# Altium project VOU_SOM_CV_V0.0.1.PrjPcb (part 2 of 2)

## Sheet Conn_C.SchDoc
size A1
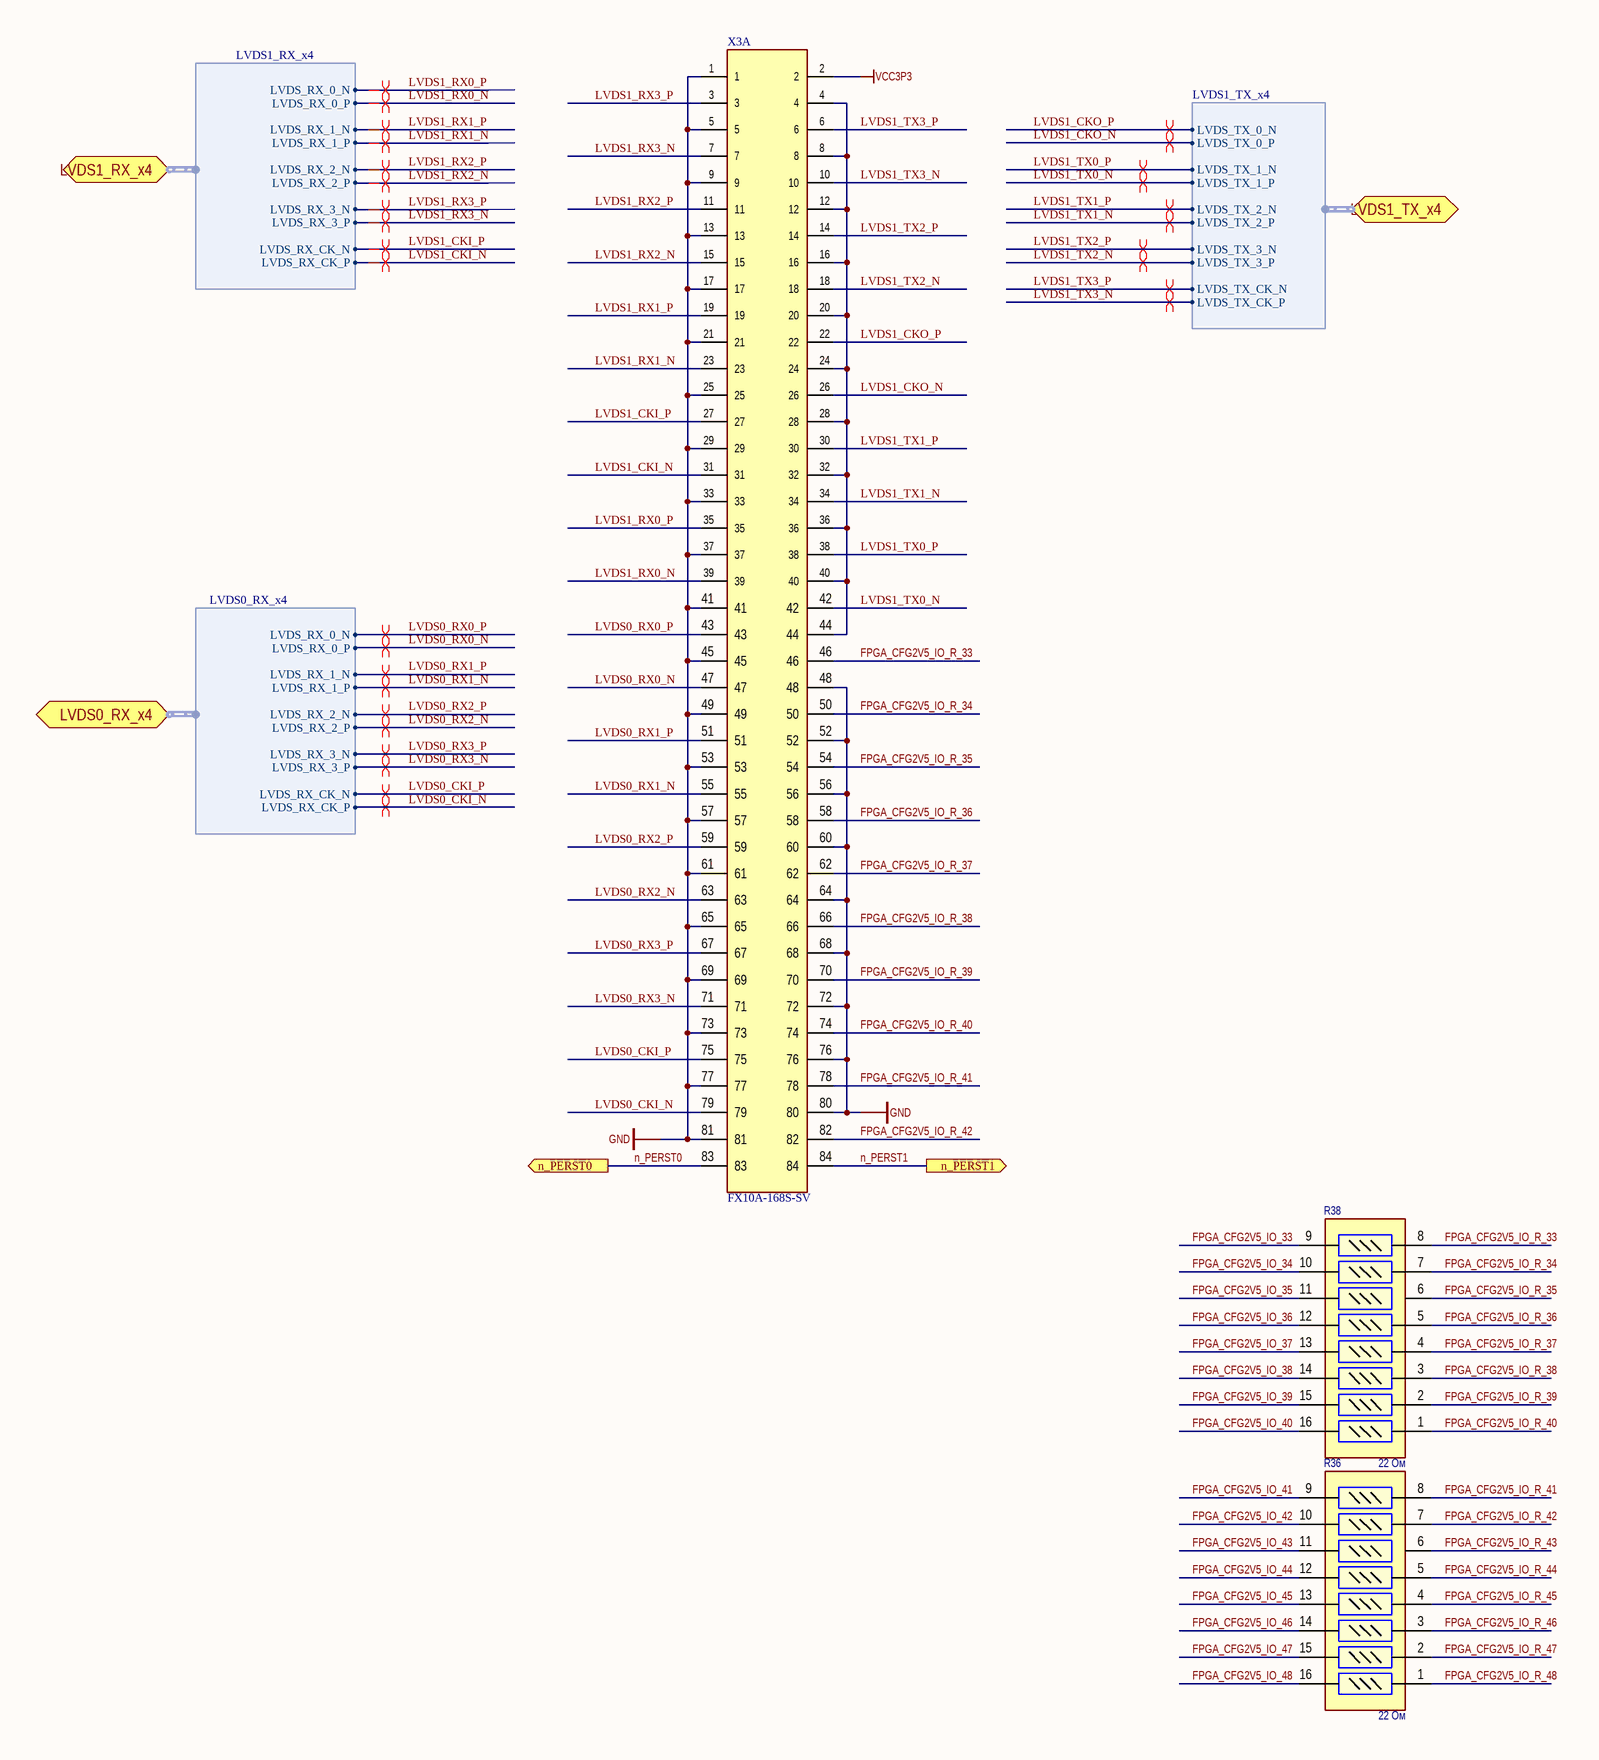
[diagram p9: Conn_C.SchDoc, left]
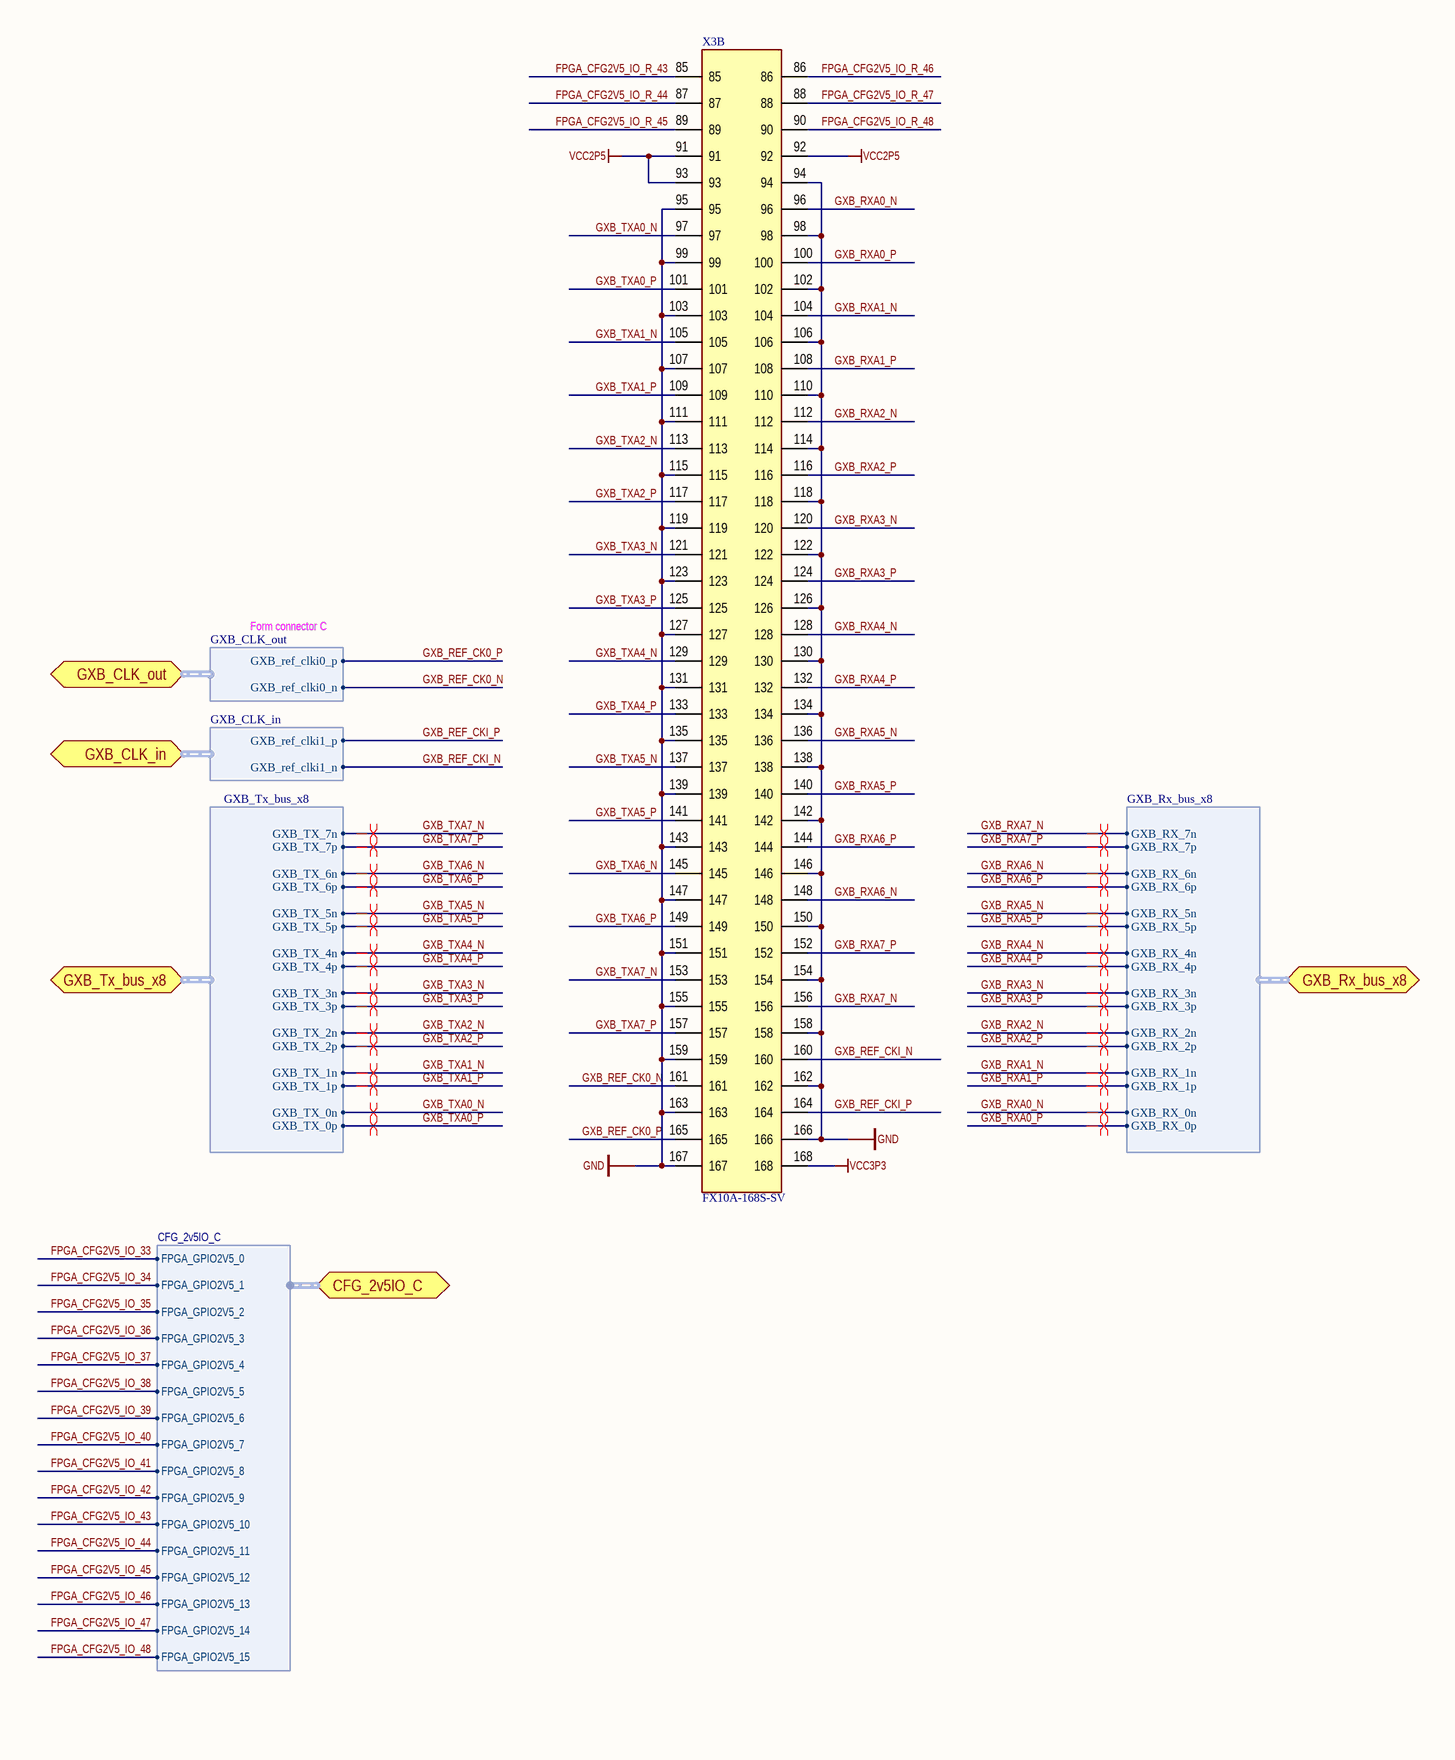
[diagram p10: Conn_C.SchDoc, right]

### Parts
R36  value 22 Ом  [CAT16-J8]  (hidden comment: YC248-JR-07-22 Ом)
R38  value 22 Ом  [CAT16-J8]  (hidden comment: YC248-JR-07-22 Ом)
X3  FX10A-168S-SV  [FX10A-168S-SV]  (parts A,B of 2)

### Ports
CFG_2v5IO_С (harness CFG_2v5IO_С), GXB_CLK_in (harness GXB_CLK_in), GXB_CLK_out (harness GXB_CLK_out), GXB_Rx_bus_x8 (harness GXB_Rx_bus_x8), GXB_Tx_bus_x8 (harness GXB_Tx_bus_x8), LVDS0_RX_x4 (harness LVDS0_RX_x4), LVDS1_RX_x4 (harness LVDS1_RX_x4), LVDS1_TX_x4 (harness LVDS1_TX_x4), n_PERST0 (out), n_PERST1 (out)

### Harnesses
GXB_Tx_bus_x8: GXB_TX_0p, GXB_TX_0n, GXB_TX_1p, GXB_TX_1n, GXB_TX_2p, GXB_TX_2n, GXB_TX_3p, GXB_TX_3n, GXB_TX_4p, GXB_TX_4n, GXB_TX_5p, GXB_TX_5n, GXB_TX_6p, GXB_TX_6n, GXB_TX_7p, GXB_TX_7n
GXB_Rx_bus_x8: GXB_RX_0p, GXB_RX_0n, GXB_RX_1p, GXB_RX_1n, GXB_RX_2p, GXB_RX_2n, GXB_RX_3p, GXB_RX_3n, GXB_RX_4p, GXB_RX_4n, GXB_RX_5p, GXB_RX_5n, GXB_RX_6p, GXB_RX_6n, GXB_RX_7p, GXB_RX_7n
LVDS0_RX_x4: LVDS_RX_0_P, LVDS_RX_0_N, LVDS_RX_1_P, LVDS_RX_1_N, LVDS_RX_2_P, LVDS_RX_2_N, LVDS_RX_3_P, LVDS_RX_3_N, LVDS_RX_CK_P, LVDS_RX_CK_N
LVDS1_TX_x4: LVDS_TX_0_P, LVDS_TX_0_N, LVDS_TX_1_P, LVDS_TX_1_N, LVDS_TX_2_P, LVDS_TX_2_N, LVDS_TX_3_P, LVDS_TX_3_N, LVDS_TX_CK_P, LVDS_TX_CK_N
LVDS1_RX_x4: LVDS_RX_0_P, LVDS_RX_0_N, LVDS_RX_1_P, LVDS_RX_1_N, LVDS_RX_2_P, LVDS_RX_2_N, LVDS_RX_3_P, LVDS_RX_3_N, LVDS_RX_CK_P, LVDS_RX_CK_N
GXB_CLK_out: GXB_ref_clki0_p, GXB_ref_clki0_n
GXB_CLK_in: GXB_ref_clki1_p, GXB_ref_clki1_n
CFG_2v5IO_С: FPGA_GPIO2V5_0, FPGA_GPIO2V5_1, FPGA_GPIO2V5_2, FPGA_GPIO2V5_3, FPGA_GPIO2V5_4, FPGA_GPIO2V5_5, FPGA_GPIO2V5_6, FPGA_GPIO2V5_7, FPGA_GPIO2V5_8, FPGA_GPIO2V5_9, FPGA_GPIO2V5_10, FPGA_GPIO2V5_11, FPGA_GPIO2V5_12, FPGA_GPIO2V5_13, FPGA_GPIO2V5_14, FPGA_GPIO2V5_15

### Nets
GND: X3.1 X3.5 X3.9 X3.13 X3.17 X3.21 X3.25 X3.29 X3.33 X3.37 X3.41 X3.45 X3.48 X3.49 X3.52 X3.53 X3.56 X3.57 X3.60 X3.61 X3.64 X3.65 X3.68 X3.69 X3.72 X3.73 X3.76 X3.77 X3.80 X3.81 X3.94 X3.95 X3.98 X3.99 X3.102 X3.103 X3.106 X3.107 X3.110 X3.111 X3.114 X3.115 X3.118 X3.119 X3.122 X3.123 X3.126 X3.127 X3.130 X3.131 X3.134 X3.135 X3.138 X3.139 X3.142 X3.143 X3.146 X3.147 X3.150 X3.151 X3.154 X3.155 X3.158 X3.159 X3.162 X3.163 X3.166 X3.167  [project net MIPI_CSI_CLKA_N]
VCC2P5: X3.91 X3.92 X3.93
VCC3P3: X3.2 X3.168
FPGA_CFG2V5_IO_33: R38.9 ; port CFG_2v5IO_С.FPGA_GPIO2V5_0
FPGA_CFG2V5_IO_34: R38.10 ; port CFG_2v5IO_С.FPGA_GPIO2V5_1
FPGA_CFG2V5_IO_35: R38.11 ; port CFG_2v5IO_С.FPGA_GPIO2V5_2
FPGA_CFG2V5_IO_36: R38.12 ; port CFG_2v5IO_С.FPGA_GPIO2V5_3
FPGA_CFG2V5_IO_37: R38.13 ; port CFG_2v5IO_С.FPGA_GPIO2V5_4
FPGA_CFG2V5_IO_38: R38.14 ; port CFG_2v5IO_С.FPGA_GPIO2V5_5
FPGA_CFG2V5_IO_39: R38.15 ; port CFG_2v5IO_С.FPGA_GPIO2V5_6
FPGA_CFG2V5_IO_40: R38.16 ; port CFG_2v5IO_С.FPGA_GPIO2V5_7
FPGA_CFG2V5_IO_41: R36.9 ; port CFG_2v5IO_С.FPGA_GPIO2V5_8
FPGA_CFG2V5_IO_42: R36.10 ; port CFG_2v5IO_С.FPGA_GPIO2V5_9
FPGA_CFG2V5_IO_43: R36.11 ; port CFG_2v5IO_С.FPGA_GPIO2V5_10
FPGA_CFG2V5_IO_44: R36.12 ; port CFG_2v5IO_С.FPGA_GPIO2V5_11
FPGA_CFG2V5_IO_45: R36.13 ; port CFG_2v5IO_С.FPGA_GPIO2V5_12
FPGA_CFG2V5_IO_46: R36.14 ; port CFG_2v5IO_С.FPGA_GPIO2V5_13
FPGA_CFG2V5_IO_47: R36.15 ; port CFG_2v5IO_С.FPGA_GPIO2V5_14
FPGA_CFG2V5_IO_48: R36.16 ; port CFG_2v5IO_С.FPGA_GPIO2V5_15
FPGA_CFG2V5_IO_R_33: R38.8 X3.46
FPGA_CFG2V5_IO_R_34: R38.7 X3.50
FPGA_CFG2V5_IO_R_35: R38.6 X3.54
FPGA_CFG2V5_IO_R_36: R38.5 X3.58
FPGA_CFG2V5_IO_R_37: R38.4 X3.62
FPGA_CFG2V5_IO_R_38: R38.3 X3.66
FPGA_CFG2V5_IO_R_39: R38.2 X3.70
FPGA_CFG2V5_IO_R_40: R38.1 X3.74
FPGA_CFG2V5_IO_R_41: R36.8 X3.78
FPGA_CFG2V5_IO_R_42: R36.7 X3.82
FPGA_CFG2V5_IO_R_43: R36.6 X3.85
FPGA_CFG2V5_IO_R_44: R36.5 X3.87
FPGA_CFG2V5_IO_R_45: R36.4 X3.89
FPGA_CFG2V5_IO_R_46: R36.3 X3.86
FPGA_CFG2V5_IO_R_47: R36.2 X3.88
FPGA_CFG2V5_IO_R_48: R36.1 X3.90
GXB_REF_CK0_N: X3.161 ; port GXB_CLK_out.GXB_ref_clki0_n
GXB_REF_CK0_P: X3.165 ; port GXB_CLK_out.GXB_ref_clki0_p
GXB_REF_CKI_N: X3.160 ; port GXB_CLK_in.GXB_ref_clki1_n
GXB_REF_CKI_P: X3.164 ; port GXB_CLK_in.GXB_ref_clki1_p
GXB_RXA0_N: X3.96 ; port GXB_Rx_bus_x8.GXB_RX_0n
GXB_RXA0_P: X3.100 ; port GXB_Rx_bus_x8.GXB_RX_0p
GXB_RXA1_N: X3.104 ; port GXB_Rx_bus_x8.GXB_RX_1n
GXB_RXA1_P: X3.108 ; port GXB_Rx_bus_x8.GXB_RX_1p
GXB_RXA2_N: X3.112 ; port GXB_Rx_bus_x8.GXB_RX_2n
GXB_RXA2_P: X3.116 ; port GXB_Rx_bus_x8.GXB_RX_2p
GXB_RXA3_N: X3.120 ; port GXB_Rx_bus_x8.GXB_RX_3n
GXB_RXA3_P: X3.124 ; port GXB_Rx_bus_x8.GXB_RX_3p
GXB_RXA4_N: X3.128 ; port GXB_Rx_bus_x8.GXB_RX_4n
GXB_RXA4_P: X3.132 ; port GXB_Rx_bus_x8.GXB_RX_4p
GXB_RXA5_N: X3.136 ; port GXB_Rx_bus_x8.GXB_RX_5n
GXB_RXA5_P: X3.140 ; port GXB_Rx_bus_x8.GXB_RX_5p
GXB_RXA6_N: X3.148 ; port GXB_Rx_bus_x8.GXB_RX_6n
GXB_RXA6_P: X3.144 ; port GXB_Rx_bus_x8.GXB_RX_6p
GXB_RXA7_N: X3.156 ; port GXB_Rx_bus_x8.GXB_RX_7n
GXB_RXA7_P: X3.152 ; port GXB_Rx_bus_x8.GXB_RX_7p
GXB_TXA0_N: X3.97 ; port GXB_Tx_bus_x8.GXB_TX_0n
GXB_TXA0_P: X3.101 ; port GXB_Tx_bus_x8.GXB_TX_0p
GXB_TXA1_N: X3.105 ; port GXB_Tx_bus_x8.GXB_TX_1n
GXB_TXA1_P: X3.109 ; port GXB_Tx_bus_x8.GXB_TX_1p
GXB_TXA2_N: X3.113 ; port GXB_Tx_bus_x8.GXB_TX_2n
GXB_TXA2_P: X3.117 ; port GXB_Tx_bus_x8.GXB_TX_2p
GXB_TXA3_N: X3.121 ; port GXB_Tx_bus_x8.GXB_TX_3n
GXB_TXA3_P: X3.125 ; port GXB_Tx_bus_x8.GXB_TX_3p
GXB_TXA4_N: X3.129 ; port GXB_Tx_bus_x8.GXB_TX_4n
GXB_TXA4_P: X3.133 ; port GXB_Tx_bus_x8.GXB_TX_4p
GXB_TXA5_N: X3.137 ; port GXB_Tx_bus_x8.GXB_TX_5n
GXB_TXA5_P: X3.141 ; port GXB_Tx_bus_x8.GXB_TX_5p
GXB_TXA6_N: X3.145 ; port GXB_Tx_bus_x8.GXB_TX_6n
GXB_TXA6_P: X3.149 ; port GXB_Tx_bus_x8.GXB_TX_6p
GXB_TXA7_N: X3.153 ; port GXB_Tx_bus_x8.GXB_TX_7n
GXB_TXA7_P: X3.157 ; port GXB_Tx_bus_x8.GXB_TX_7p
LVDS0_CKI_N: X3.79 ; port LVDS0_RX_x4.LVDS_RX_CK_P
LVDS0_CKI_P: X3.75 ; port LVDS0_RX_x4.LVDS_RX_CK_N
LVDS0_RX0_N: X3.47 ; port LVDS0_RX_x4.LVDS_RX_0_P
LVDS0_RX0_P: X3.43 ; port LVDS0_RX_x4.LVDS_RX_0_N
LVDS0_RX1_N: X3.55 ; port LVDS0_RX_x4.LVDS_RX_1_P
LVDS0_RX1_P: X3.51 ; port LVDS0_RX_x4.LVDS_RX_1_N
LVDS0_RX2_N: X3.63 ; port LVDS0_RX_x4.LVDS_RX_2_P
LVDS0_RX2_P: X3.59 ; port LVDS0_RX_x4.LVDS_RX_2_N
LVDS0_RX3_N: X3.71 ; port LVDS0_RX_x4.LVDS_RX_3_P
LVDS0_RX3_P: X3.67 ; port LVDS0_RX_x4.LVDS_RX_3_N
LVDS1_CKI_N: X3.31 ; port LVDS1_RX_x4.LVDS_RX_CK_P
LVDS1_CKI_P: X3.27 ; port LVDS1_RX_x4.LVDS_RX_CK_N
LVDS1_CKO_N: X3.26 ; port LVDS1_TX_x4.LVDS_TX_0_P
LVDS1_CKO_P: X3.22 ; port LVDS1_TX_x4.LVDS_TX_0_N
LVDS1_RX0_N: X3.39 ; port LVDS1_RX_x4.LVDS_RX_0_P
LVDS1_RX0_P: X3.35 ; port LVDS1_RX_x4.LVDS_RX_0_N
LVDS1_RX1_N: X3.23 ; port LVDS1_RX_x4.LVDS_RX_1_P
LVDS1_RX1_P: X3.19 ; port LVDS1_RX_x4.LVDS_RX_1_N
LVDS1_RX2_N: X3.15 ; port LVDS1_RX_x4.LVDS_RX_2_P
LVDS1_RX2_P: X3.11 ; port LVDS1_RX_x4.LVDS_RX_2_N
LVDS1_RX3_N: X3.7 ; port LVDS1_RX_x4.LVDS_RX_3_P
LVDS1_RX3_P: X3.3 ; port LVDS1_RX_x4.LVDS_RX_3_N
LVDS1_TX0_N: X3.42 ; port LVDS1_TX_x4.LVDS_TX_1_P
LVDS1_TX0_P: X3.38 ; port LVDS1_TX_x4.LVDS_TX_1_N
LVDS1_TX1_N: X3.34 ; port LVDS1_TX_x4.LVDS_TX_2_P
LVDS1_TX1_P: X3.30 ; port LVDS1_TX_x4.LVDS_TX_2_N
LVDS1_TX2_N: X3.18 ; port LVDS1_TX_x4.LVDS_TX_3_P
LVDS1_TX2_P: X3.14 ; port LVDS1_TX_x4.LVDS_TX_3_N
LVDS1_TX3_N: X3.10 ; port LVDS1_TX_x4.LVDS_TX_CK_P
LVDS1_TX3_P: X3.6 ; port LVDS1_TX_x4.LVDS_TX_CK_N
n_PERST0: X3.83 ; port n_PERST0
n_PERST1: X3.84 ; port n_PERST1
NetX3_4: X3.4 X3.8 X3.12 X3.16 X3.20 X3.24 X3.28 X3.32 X3.36 X3.40 X3.44

### Layout directives
differential pair: GXB_RXA0_N, GXB_RXA0_P, GXB_RXA1_N, GXB_RXA1_P, GXB_RXA2_N, GXB_RXA2_P, GXB_RXA3_N, GXB_RXA3_P, GXB_RXA4_N, GXB_RXA4_P, GXB_RXA5_N, GXB_RXA5_P, GXB_RXA6_N, GXB_RXA6_P, GXB_RXA7_N, GXB_RXA7_P, GXB_TXA0_N, GXB_TXA0_P, GXB_TXA1_N, GXB_TXA1_P, GXB_TXA2_N, GXB_TXA2_P, GXB_TXA3_N, GXB_TXA3_P, GXB_TXA4_N, GXB_TXA4_P, GXB_TXA5_N, GXB_TXA5_P, GXB_TXA6_N, GXB_TXA6_P, GXB_TXA7_N, GXB_TXA7_P, LVDS0_CKI_N, LVDS0_CKI_P, LVDS0_RX0_N, LVDS0_RX0_P, LVDS0_RX1_N, LVDS0_RX1_P, LVDS0_RX2_N, LVDS0_RX2_P, LVDS0_RX3_N, LVDS0_RX3_P, LVDS1_CKI_N, LVDS1_CKI_P, LVDS1_CKO_N, LVDS1_CKO_P, LVDS1_RX0_N, LVDS1_RX0_P, LVDS1_RX1_N, LVDS1_RX1_P, LVDS1_RX2_N, LVDS1_RX2_P, LVDS1_RX3_N, LVDS1_RX3_P, LVDS1_TX0_N, LVDS1_TX0_P, LVDS1_TX1_N, LVDS1_TX1_P, LVDS1_TX2_N, LVDS1_TX2_P, LVDS1_TX3_N, LVDS1_TX3_P

### Notes on the sheet
- Form connector C

### Library data of the parts
R36 R38 = YC248-JR-07-#: Набор чип резисторов; P: 0.062 Вт; Supplier 1: Digi-Key; Supplier Part Number 1: YC248-JR-0722RL

## Sheet HPS_DDR3.SchDoc
size A1
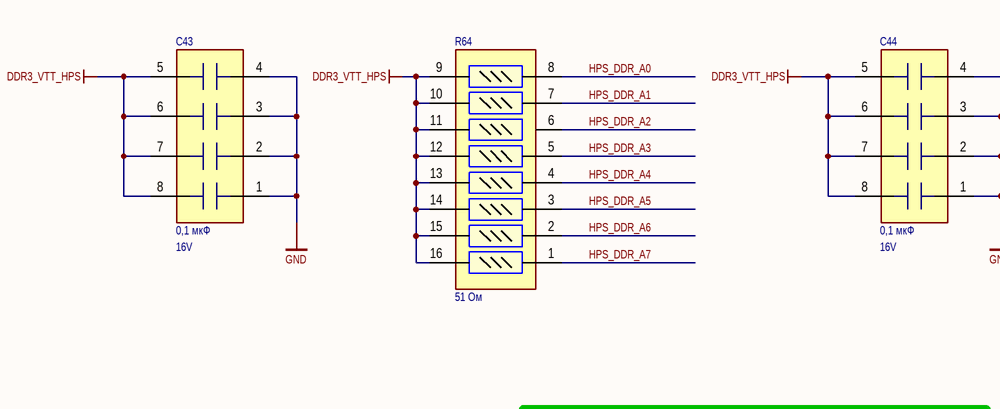
[diagram p11: HPS_DDR3.SchDoc, top left]
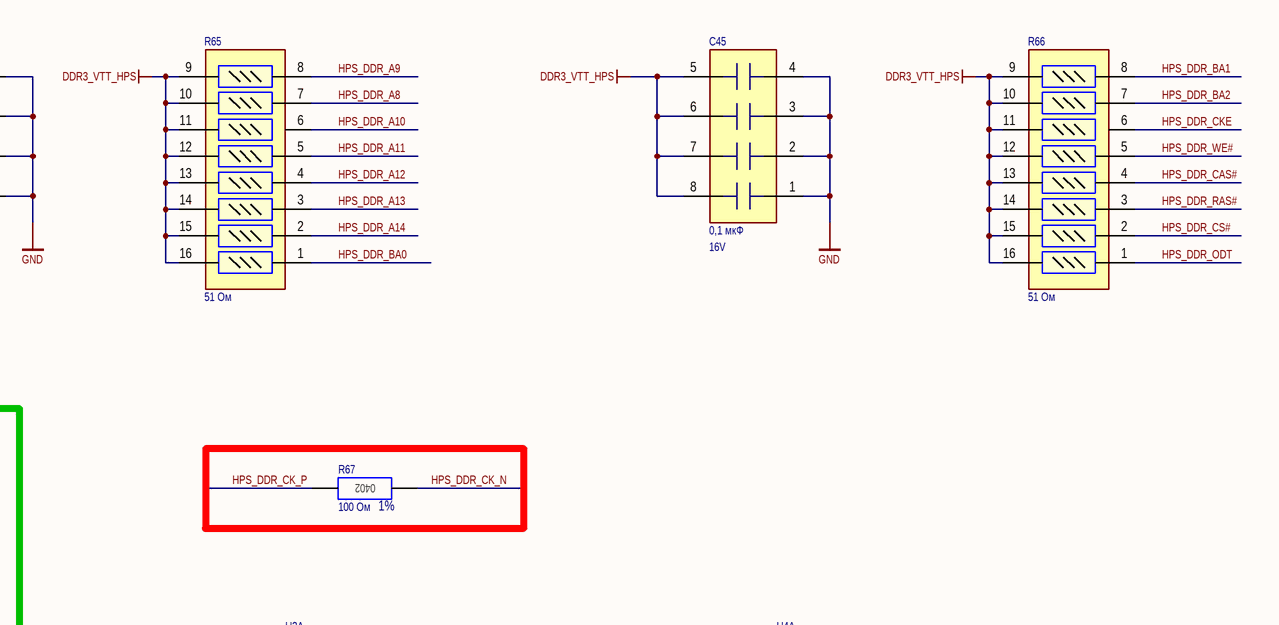
[diagram p12: HPS_DDR3.SchDoc, top right]
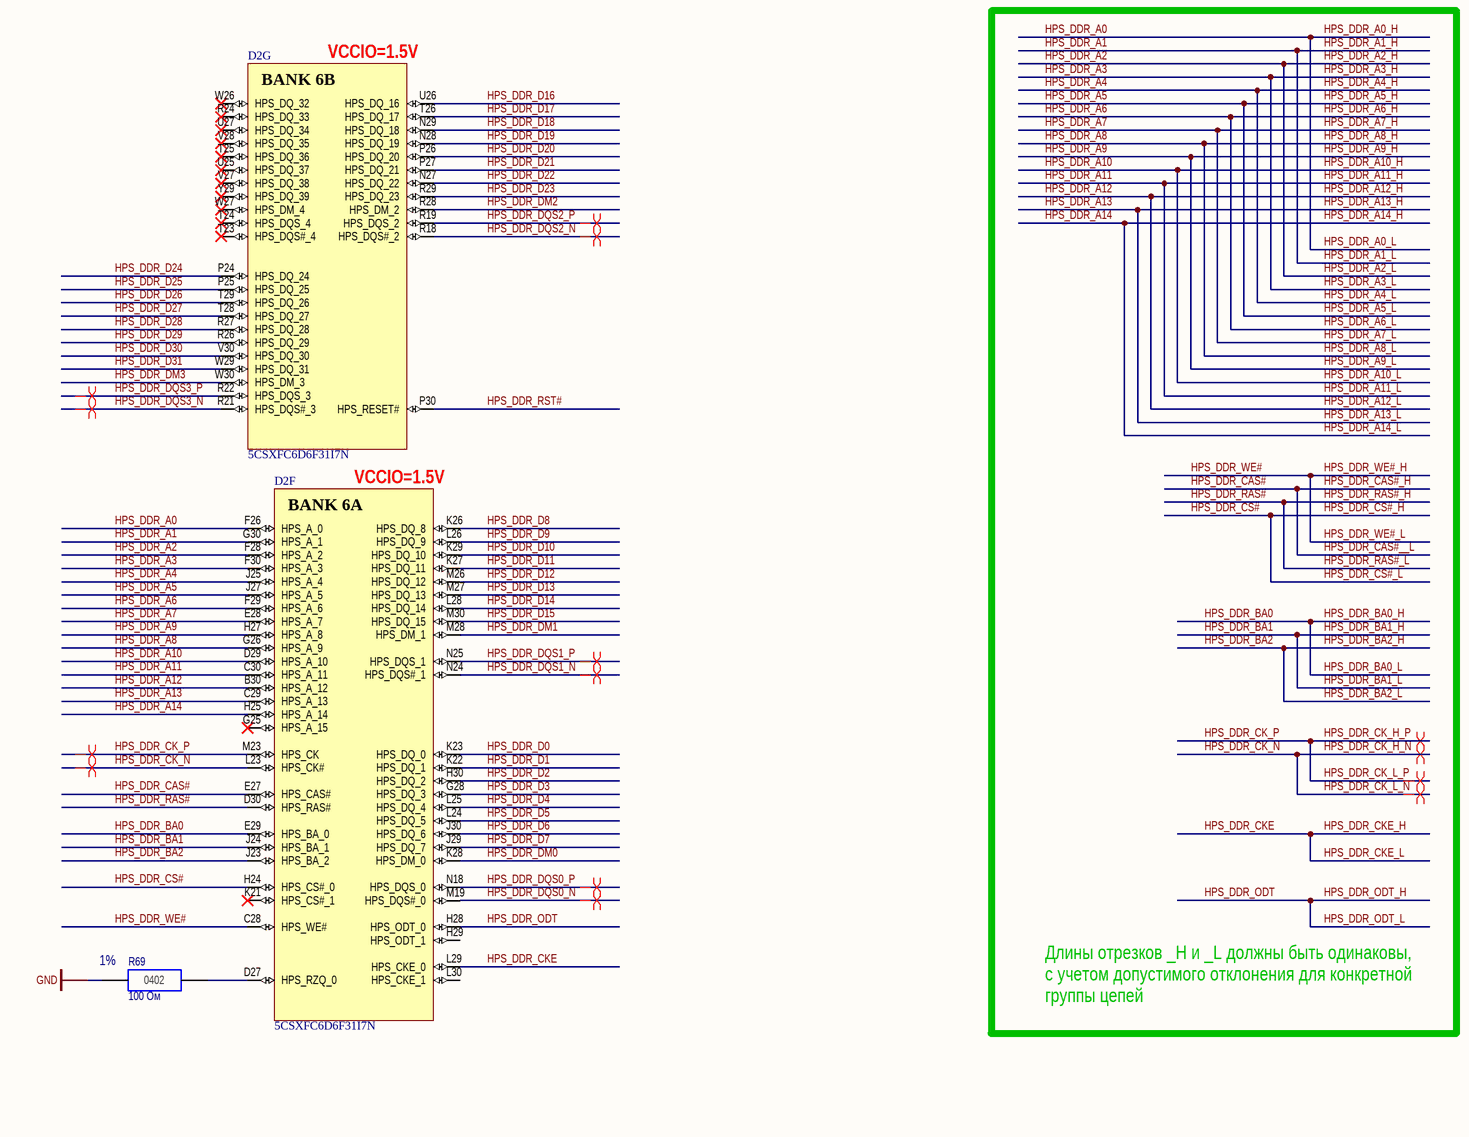
[diagram p13: HPS_DDR3.SchDoc, bottom left]
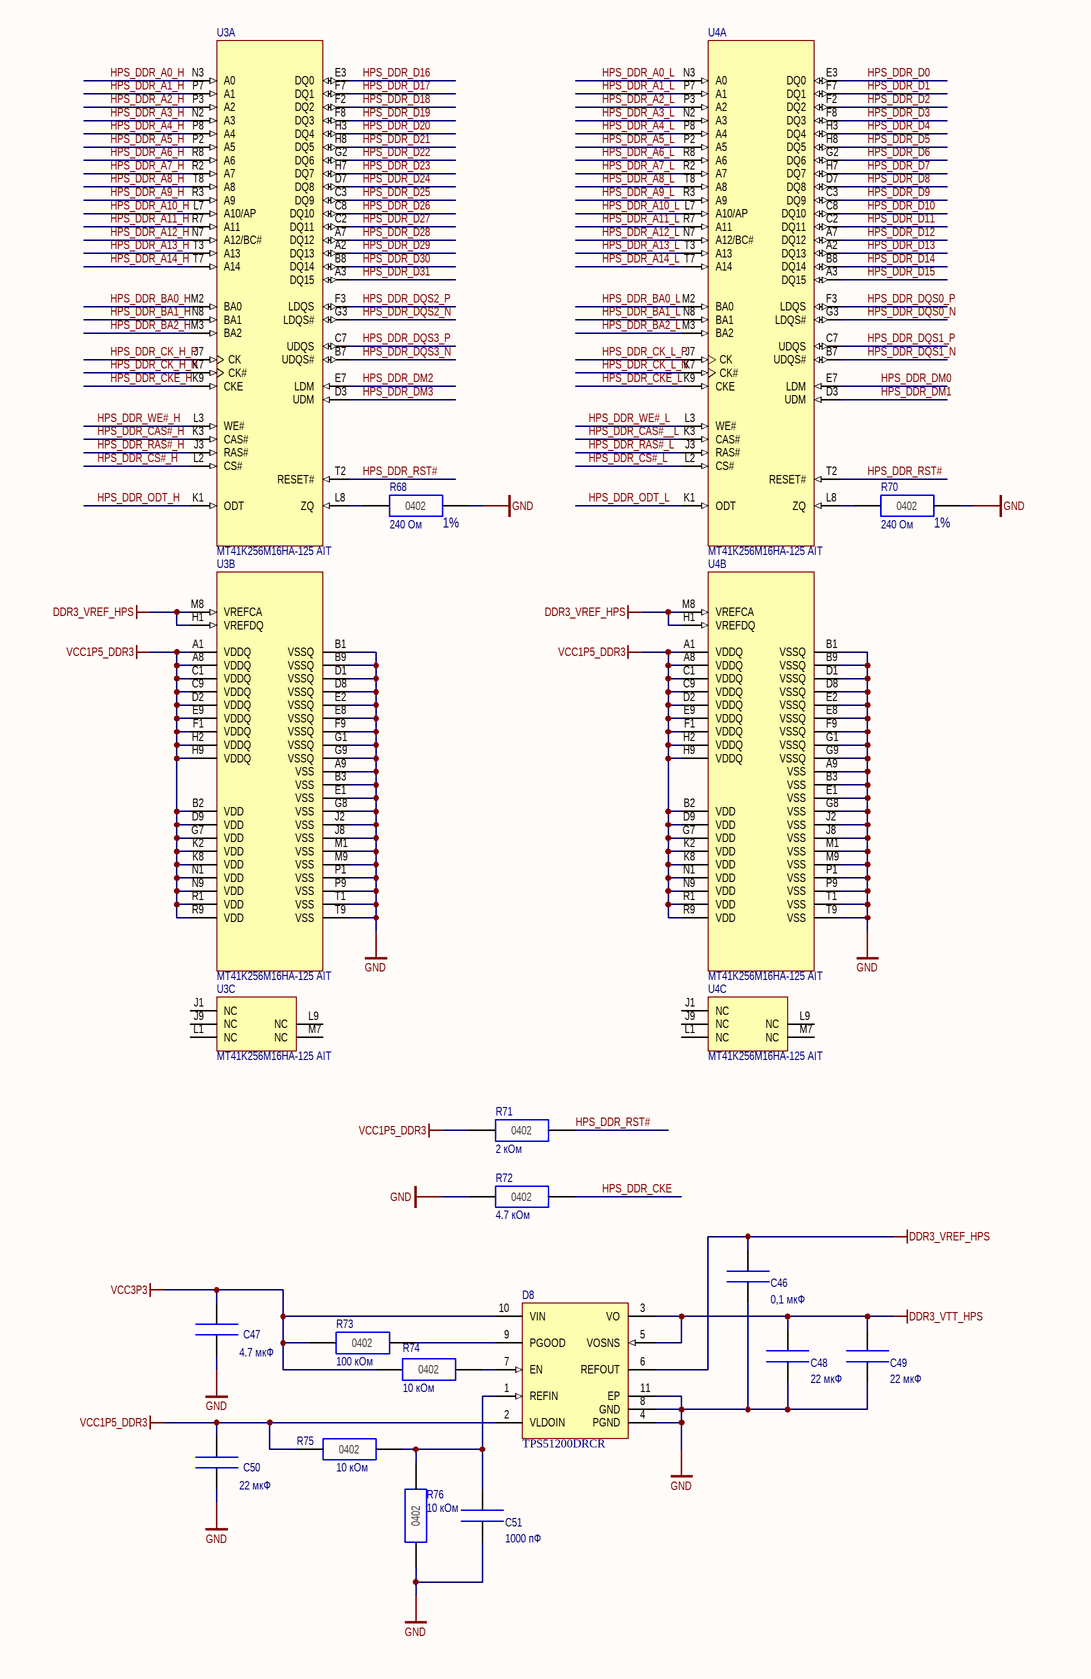
[diagram p14: HPS_DDR3.SchDoc, bottom right]

### Parts
C43  value 0,1 мкФ  V: 16V  [CAF-80P319X159-8N]  (hidden comment: W3A4YC104KAT2A)
C44  value 0,1 мкФ  V: 16V  [CAF-80P319X159-8N]  (hidden comment: W3A4YC104KAT2A)
C45  value 0,1 мкФ  V: 16V  [CAF-80P319X159-8N]  (hidden comment: W3A4YC104KAT2A)
C46  value 0,1 мкФ  [CC0402(1005)]  (hidden comment: CC0402-X7R-0,1 мкФ-20%-10В)
C47  value 4.7 мкФ  [CC0402(1005)]  (hidden comment: CC0402-X5R-4.7 мкФ-20%-6.3В)
C48  value 22 мкФ  [CC0402(1005)]  (hidden comment: CC0402-X5R-22 мкФ-20%-6.3В)
C49  value 22 мкФ  [CC0402(1005)]  (hidden comment: CC0402-X5R-22 мкФ-20%-6.3В)
C50  value 22 мкФ  [CC0402(1005)]  (hidden comment: CC0402-X5R-22 мкФ-20%-6.3В)
C51  value 1000 пФ  [CC0402(1005)]  (hidden comment: CC0402-NP01000 пФ-1%-50В)
D2  5CSXFC6D6F31I7N  [ALTR-FBGA896_A-200]  (parts F,G of 24)
D8  TPS51200DRCR  [TI-DRC10-2400X1650TP_V]
R64  value 51 Ом  [CAT16-J8]  (hidden comment: YC248-JR-07-51 Ом)
R65  value 51 Ом  [CAT16-J8]  (hidden comment: YC248-JR-07-51 Ом)
R66  value 51 Ом  [CAT16-J8]  (hidden comment: YC248-JR-07-51 Ом)
R67  value 100 Ом  TOLERANCE: 1%  [CR0402(1005)]  (hidden comment: CR0402-100 Ом-±TOLERANCE)
R68  value 240 Ом  TOLERANCE: 1%  [CR0402(1005)]  (hidden comment: CR0402-240 Ом-±TOLERANCE)
R69  value 100 Ом  TOLERANCE: 1%  [CR0402(1005)]  (hidden comment: CR0402-100 Ом-±TOLERANCE)
R70  value 240 Ом  TOLERANCE: 1%  [CR0402(1005)]  (hidden comment: CR0402-240 Ом-±TOLERANCE)
R71  value 2 кОм  [CR0402(1005)]  (hidden comment: CR0402-2 кОм-±5%)
R72  value 4.7 кОм  [CR0402(1005)]  (hidden comment: CR0402-4.7 кОм-±5%)
R73  value 100 кОм  [CR0402(1005)]  (hidden comment: CR0402-100 кОм-±5%)
R74  value 10 кОм  [CR0402(1005)]  (hidden comment: CR0402-10 кОм-±5%)
R75  value 10 кОм  [CR0402(1005)]  (hidden comment: CR0402-10 кОм-±5%)
R76  value 10 кОм  [CR0402(1005)]  (hidden comment: CR0402-10 кОм-±5%)
U3  MT41K256M16HA-125 AIT  [MICT-HA-96]  (parts A,B,C of 3)
U4  MT41K256M16HA-125 AIT  [MICT-HA-96]  (parts A,B,C of 3)

### Nets
DDR3_VREF_HPS: C46.1(+) D8.6(REFOUT) U3.H1(VREFDQ) U3.M8(VREFCA) U4.H1(VREFDQ) U4.M8(VREFCA)
DDR3_VTT_HPS: C43.5 C43.6 C43.7 C43.8 C44.5 C44.6 C44.7 C44.8 C45.5 C45.6 C45.7 C45.8 C48.1(+) C49.1(+) D8.3(VO) D8.5(VOSNS) R64.9 R64.10 R64.11 R64.12 R64.13 R64.14 R64.15 R64.16 R65.9 R65.10 R65.11 R65.12 R65.13 R65.14 R65.15 R65.16 R66.9 R66.10 R66.11 R66.12 R66.13 R66.14 R66.15 R66.16
GND: C43.1 C43.2 C43.3 C43.4 C44.1 C44.2 C44.3 C44.4 C45.1 C45.2 C45.3 C45.4 C46.2(-) C47.2(-) C48.2(-) C49.2(-) C50.2(-) C51.2(-) D8.4(PGND) D8.8(GND) D8.11(EP) R68.2(-) R69.1(+) R70.2(-) R72.1(+) R76.1(+) U3.A9(VSS) U3.B1(VSSQ) U3.B3(VSS) U3.B9(VSSQ) U3.D1(VSSQ) U3.D8(VSSQ) U3.E1(VSS) U3.E2(VSSQ) U3.E8(VSSQ) U3.F9(VSSQ) U3.G1(VSSQ) U3.G8(VSS) U3.G9(VSSQ) U3.J2(VSS) U3.J8(VSS) U3.M1(VSS) U3.M9(VSS) U3.P1(VSS) U3.P9(VSS) U3.T1(VSS) U3.T9(VSS) U4.A9(VSS) U4.B1(VSSQ) U4.B3(VSS) U4.B9(VSSQ) U4.D1(VSSQ) U4.D8(VSSQ) U4.E1(VSS) U4.E2(VSSQ) U4.E8(VSSQ) U4.F9(VSSQ) U4.G1(VSSQ) U4.G8(VSS) U4.G9(VSSQ) U4.J2(VSS) U4.J8(VSS) U4.M1(VSS) U4.M9(VSS) U4.P1(VSS) U4.P9(VSS) U4.T1(VSS) U4.T9(VSS)  [project net MIPI_CSI_CLKA_N]
VCC1P5_DDR3: C50.1(+) D8.2(VLDOIN) R71.1(+) R75.1(+) U3.A1(VDDQ) U3.A8(VDDQ) U3.B2(VDD) U3.C1(VDDQ) U3.C9(VDDQ) U3.D2(VDDQ) U3.D9(VDD) U3.E9(VDDQ) U3.F1(VDDQ) U3.G7(VDD) U3.H2(VDDQ) U3.H9(VDDQ) U3.K2(VDD) U3.K8(VDD) U3.N1(VDD) U3.N9(VDD) U3.R1(VDD) U3.R9(VDD) U4.A1(VDDQ) U4.A8(VDDQ) U4.B2(VDD) U4.C1(VDDQ) U4.C9(VDDQ) U4.D2(VDDQ) U4.D9(VDD) U4.E9(VDDQ) U4.F1(VDDQ) U4.G7(VDD) U4.H2(VDDQ) U4.H9(VDDQ) U4.K2(VDD) U4.K8(VDD) U4.N1(VDD) U4.N9(VDD) U4.R1(VDD) U4.R9(VDD)
VCC3P3: C47.1(+) D8.10(VIN) R73.1(+) R74.1(+)
HPS_DDR_A0: D2.F26(HPS_A_0) R64.8 U3.N3(A0) U4.N3(A0)  [also labelled HPS_DDR_A0_H, HPS_DDR_A0_L]
HPS_DDR_A1: D2.G30(HPS_A_1) R64.7 U3.P7(A1) U4.P7(A1)  [also labelled HPS_DDR_A1_H, HPS_DDR_A1_L]
HPS_DDR_A2: D2.F28(HPS_A_2) R64.6 U3.P3(A2) U4.P3(A2)  [also labelled HPS_DDR_A2_H, HPS_DDR_A2_L]
HPS_DDR_A3: D2.F30(HPS_A_3) R64.5 U3.N2(A3) U4.N2(A3)  [also labelled HPS_DDR_A3_H, HPS_DDR_A3_L]
HPS_DDR_A4: D2.J25(HPS_A_4) R64.4 U3.P8(A4) U4.P8(A4)  [also labelled HPS_DDR_A4_H, HPS_DDR_A4_L]
HPS_DDR_A5: D2.J27(HPS_A_5) R64.3 U3.P2(A5) U4.P2(A5)  [also labelled HPS_DDR_A5_H, HPS_DDR_A5_L]
HPS_DDR_A6: D2.F29(HPS_A_6) R64.2 U3.R8(A6) U4.R8(A6)  [also labelled HPS_DDR_A6_H, HPS_DDR_A6_L]
HPS_DDR_A7: D2.E28(HPS_A_7) R64.1 U3.R2(A7) U4.R2(A7)  [also labelled HPS_DDR_A7_H, HPS_DDR_A7_L]
HPS_DDR_A8: D2.G26(HPS_A_9) R65.7 U3.T8(A8) U4.T8(A8)  [also labelled HPS_DDR_A8_H, HPS_DDR_A8_L]
HPS_DDR_A9: D2.H27(HPS_A_8) R65.8 U3.R3(A9) U4.R3(A9)  [also labelled HPS_DDR_A9_H, HPS_DDR_A9_L]
HPS_DDR_A10: D2.D29(HPS_A_10) R65.6 U3.L7(A10/AP) U4.L7(A10/AP)  [also labelled HPS_DDR_A10_H, HPS_DDR_A10_L]
HPS_DDR_A11: D2.C30(HPS_A_11) R65.5 U3.R7(A11) U4.R7(A11)  [also labelled HPS_DDR_A11_H, HPS_DDR_A11_L]
HPS_DDR_A12: D2.B30(HPS_A_12) R65.4 U3.N7(A12/BC#) U4.N7(A12/BC#)  [also labelled HPS_DDR_A12_H, HPS_DDR_A12_L]
HPS_DDR_A13: D2.C29(HPS_A_13) R65.3 U3.T3(A13) U4.T3(A13)  [also labelled HPS_DDR_A13_H, HPS_DDR_A13_L]
HPS_DDR_A14: D2.H25(HPS_A_14) R65.2 U3.T7(A14) U4.T7(A14)  [also labelled HPS_DDR_A14_H, HPS_DDR_A14_L]
HPS_DDR_BA0: D2.E29(HPS_BA_0) R65.1 U3.M2(BA0) U4.M2(BA0)  [also labelled HPS_DDR_BA0_H, HPS_DDR_BA0_L]
HPS_DDR_BA1: D2.J24(HPS_BA_1) R66.8 U3.N8(BA1) U4.N8(BA1)  [also labelled HPS_DDR_BA1_H, HPS_DDR_BA1_L]
HPS_DDR_BA2: D2.J23(HPS_BA_2) R66.7 U3.M3(BA2) U4.M3(BA2)  [also labelled HPS_DDR_BA2_H, HPS_DDR_BA2_L]
HPS_DDR_CAS#: D2.E27(HPS_CAS#) R66.4 U3.K3(CAS#) U4.K3(CAS#)  [also labelled HPS_DDR_CAS#__L, HPS_DDR_CAS#_H]
HPS_DDR_CK_H_N: D2.L23(HPS_CK#) R67.1(+) U3.K7(CK#) U4.K7(CK#)  [also labelled HPS_DDR_CK_L_N, HPS_DDR_CK_N]
HPS_DDR_CK_H_P: D2.M23(HPS_CK) R67.2(-) U3.J7(CK) U4.J7(CK)  [also labelled HPS_DDR_CK_L_P, HPS_DDR_CK_P]
HPS_DDR_CKE: D2.L29(HPS_CKE_0) R66.6 R72.2(-) U3.K9(CKE) U4.K9(CKE)  [also labelled HPS_DDR_CKE_H, HPS_DDR_CKE_L]
HPS_DDR_CS#: D2.H24(HPS_CS#_0) R66.2 U3.L2(CS#) U4.L2(CS#)  [also labelled HPS_DDR_CS#_H, HPS_DDR_CS#_L]
HPS_DDR_D0: D2.K23(HPS_DQ_0) U4.E3(DQ0)
HPS_DDR_D1: D2.K22(HPS_DQ_1) U4.F7(DQ1)
HPS_DDR_D2: D2.H30(HPS_DQ_2) U4.F2(DQ2)
HPS_DDR_D3: D2.G28(HPS_DQ_3) U4.F8(DQ3)
HPS_DDR_D4: D2.L25(HPS_DQ_4) U4.H3(DQ4)
HPS_DDR_D5: D2.L24(HPS_DQ_5) U4.H8(DQ5)
HPS_DDR_D6: D2.J30(HPS_DQ_6) U4.G2(DQ6)
HPS_DDR_D7: D2.J29(HPS_DQ_7) U4.H7(DQ7)
HPS_DDR_D8: D2.K26(HPS_DQ_8) U4.D7(DQ8)
HPS_DDR_D9: D2.L26(HPS_DQ_9) U4.C3(DQ9)
HPS_DDR_D10: D2.K29(HPS_DQ_10) U4.C8(DQ10)
HPS_DDR_D11: D2.K27(HPS_DQ_11) U4.C2(DQ11)
HPS_DDR_D12: D2.M26(HPS_DQ_12) U4.A7(DQ12)
HPS_DDR_D13: D2.M27(HPS_DQ_13) U4.A2(DQ13)
HPS_DDR_D14: D2.L28(HPS_DQ_14) U4.B8(DQ14)
HPS_DDR_D15: D2.M30(HPS_DQ_15) U4.A3(DQ15)
HPS_DDR_D16: D2.U26(HPS_DQ_16) U3.E3(DQ0)
HPS_DDR_D17: D2.T26(HPS_DQ_17) U3.F7(DQ1)
HPS_DDR_D18: D2.N29(HPS_DQ_18) U3.F2(DQ2)
HPS_DDR_D19: D2.N28(HPS_DQ_19) U3.F8(DQ3)
HPS_DDR_D20: D2.P26(HPS_DQ_20) U3.H3(DQ4)
HPS_DDR_D21: D2.P27(HPS_DQ_21) U3.H8(DQ5)
HPS_DDR_D22: D2.N27(HPS_DQ_22) U3.G2(DQ6)
HPS_DDR_D23: D2.R29(HPS_DQ_23) U3.H7(DQ7)
HPS_DDR_D24: D2.P24(HPS_DQ_24) U3.D7(DQ8)
HPS_DDR_D25: D2.P25(HPS_DQ_25) U3.C3(DQ9)
HPS_DDR_D26: D2.T29(HPS_DQ_26) U3.C8(DQ10)
HPS_DDR_D27: D2.T28(HPS_DQ_27) U3.C2(DQ11)
HPS_DDR_D28: D2.R27(HPS_DQ_28) U3.A7(DQ12)
HPS_DDR_D29: D2.R26(HPS_DQ_29) U3.A2(DQ13)
HPS_DDR_D30: D2.V30(HPS_DQ_30) U3.B8(DQ14)
HPS_DDR_D31: D2.W29(HPS_DQ_31) U3.A3(DQ15)
HPS_DDR_DM0: D2.K28(HPS_DM_0) U4.E7(LDM)
HPS_DDR_DM1: D2.M28(HPS_DM_1) U4.D3(UDM)
HPS_DDR_DM2: D2.R28(HPS_DM_2) U3.E7(LDM)
HPS_DDR_DM3: D2.W30(HPS_DM_3) U3.D3(UDM)
HPS_DDR_DQS0_N: D2.M19(HPS_DQS#_0) U4.G3(LDQS#)
HPS_DDR_DQS0_P: D2.N18(HPS_DQS_0) U4.F3(LDQS)
HPS_DDR_DQS1_N: D2.N24(HPS_DQS#_1) U4.B7(UDQS#)
HPS_DDR_DQS1_P: D2.N25(HPS_DQS_1) U4.C7(UDQS)
HPS_DDR_DQS2_N: D2.R18(HPS_DQS#_2) U3.G3(LDQS#)
HPS_DDR_DQS2_P: D2.R19(HPS_DQS_2) U3.F3(LDQS)
HPS_DDR_DQS3_N: D2.R21(HPS_DQS#_3) U3.B7(UDQS#)
HPS_DDR_DQS3_P: D2.R22(HPS_DQS_3) U3.C7(UDQS)
HPS_DDR_ODT: D2.H28(HPS_ODT_0) R66.1 U3.K1(ODT) U4.K1(ODT)  [also labelled HPS_DDR_ODT_H, HPS_DDR_ODT_L]
HPS_DDR_RAS#: D2.D30(HPS_RAS#) R66.3 U3.J3(RAS#) U4.J3(RAS#)  [also labelled HPS_DDR_RAS#_H, HPS_DDR_RAS#_L]
HPS_DDR_RST#: D2.P30(HPS_RESET#) R71.2(-) U3.T2(RESET#) U4.T2(RESET#)
HPS_DDR_WE#: D2.C28(HPS_WE#) R66.5 U3.L3(WE#) U4.L3(WE#)  [also labelled HPS_DDR_WE#_H, HPS_DDR_WE#_L]
NetC51_1: C51.1(+) D8.1(REFIN) R75.2(-) R76.2(-)
NetD2_D27: D2.D27(HPS_RZQ_0) R69.2(-)
NetD8_7: D8.7(EN) R74.2(-)
NetD8_9: D8.9(PGOOD) R73.2(-)
NetR68_1: R68.1(+) U3.L8(ZQ)
NetR70_1: R70.1(+) U4.L8(ZQ)

Not connected (* = marked no-connect by the designer): D2 G25(HPS_A_15)* H29(HPS_ODT_1) K21(HPS_CS#_1)* L30(HPS_CKE_1) R24(HPS_DQ_33)* T23(HPS_DQS#_4)* T24(HPS_DQS_4)* T25(HPS_DQ_36)* U25(HPS_DQ_37)* U27(HPS_DQ_34)* V27(HPS_DQ_38)* V28(HPS_DQ_35)* W26(HPS_DQ_32)* W27(HPS_DM_4)* Y29(HPS_DQ_39)*; U3 J1(NC) J9(NC) L1(NC) L9(NC) M7(NC); U4 J1(NC) J9(NC) L1(NC) L9(NC) M7(NC)

### Layout directives
differential pair: HPS_DDR_CK_H_N, HPS_DDR_CK_H_P, HPS_DDR_DQS0_N, HPS_DDR_DQS0_P, HPS_DDR_DQS1_N, HPS_DDR_DQS1_P, HPS_DDR_DQS2_N, HPS_DDR_DQS2_P, HPS_DDR_DQS3_N, HPS_DDR_DQS3_P

### Notes on the sheet
- (near D2) VCCIO=1.5V
- Длины отрезков _H и _L должны быть одинаковы, с учетом допустимого отклонения для конкретной группы цепей
- (in symbol 5CSXFC6D6F31I7N, part F) BANK 6A
- (in symbol 5CSXFC6D6F31I7N, part G) BANK 6B
- (in symbol CR0402-#-±5%) 0402

### Library data of the parts
C43-C45 = W3A4YC104KAT2A: Чип конденсатор керамический; T: ±10%; TC: X7R; Supplier 1: Digi-Key; Supplier Part Number 1: 478-2879-2-ND
C46-C51 = CC0402-X7R-#-20%-10В: Чип конденсатор керамический; Supplier 1: Digi-Key
  C46: Supplier Part Number 1: 399-3520-1-ND
  C47-C50: Supplier Part Number 1: CC0402MRX5R4BB226
  C51: Supplier Part Number 1: GRM1555C1H102FA01D
D2 = 5CSXFC6D6F31I7N: Cyclone V SX Family FPGA, 1.07 to 1.13 V Supply, 288 I/O Pins, 6 PLLs, 896-Pin FBGA, Speed Grade 7, Industrial Grade, RoHS Compliant; Manufacturer: Altera; Logic Elements (LE) (K): 110; Speed Grade: 7; DatasheetVersion: Rev. 3.4; PackageVersion: Rev. 2.0, 12/2012; PackageReference: FBGA896_A-200; PackageDescription: 896-Pin FineLine Ball-Grid Array (FBGA), Body 31 x 31 mm, Pitch 1 mm; Supplier 1: Digi-Key; Supplier Part Number 1: 5CSXFC6D6F31I7N-ND; Supplier 2: Mouser; Supplier Part Number 2: 989-5CSXFC6D6F31I7N; Device Group: 5CSXFC6; RoHS: RoHS Compliant; Subcategory: Cyclone V SX; Voltage Supply: 1.07 to 1.13 V; NexusDeviceID: 5CSXFC6D6F31I7N; Mounting Technology: Surface Mount; Code_JEDEC: MS-034; PartNumber: 5CSXFC6D6F31I7N; ComponentLink1Description: Manufacturer URL; ComponentLink1URL: http://www.altera.com; ComponentLink2Description: Datasheet; ComponentLink2URL: http://www.altera.com/literature/hb/cyclone-v/cv_51002.pdf; ComponentLink3Description: Package Specification; ComponentLink3URL: http://www.altera.com/devicepackaging/04R00435-01.pdf; ComponentLink4Description: Device Handbook URL; ComponentLink4URL: http://www.altera.com/literature/hb/cyclone-v/cyclone5_handbook.pdf; ComponentLink5Description: Device Pin-Out URL; ComponentLink5URL: http://www.altera.com/literature/dp/cyclone-v/5CSXFC6.xls; ComponentLink6Description: Product URL; ComponentLink6URL: http://www.buyaltera.com/scripts/partsearch.dll?Detail&name=5CSXFC6D6F31I7N-ND
D8 = TPS51200DRCR: Single Output LDO, 3 A, 2.375 to 3.5 V Input, with DDR Termination, 10-pin SON (DRC), -40 to 85 degC, Green (RoHS & no Sb/Br); Manufacturer: Texas Instruments; Iout(Max)(A): 3; Iq(Typ)(mA): 0.5; Power Good: TRUE; Rating: Catalog; SubFamily: Single Channel LDO; Vin(Max)(V): 3.5; Vin(Min)(V): 2.3; DatasheetVersion: SLUS812; PackageVersion: 4204102-3/L; PackageReference: DRC10-2400X1650TP; PackageDescription: 10-Pin Plastic Small Outline, Body 3 x 3 mm, Pitch 0.5 mm; Supplier 1: Digi-Key; Supplier Part Number 1: 296-26978-2-ND; Supplier 2: Digi-Key; Supplier Part Number 2: 296-26978-1-ND; Supplier 3: Digi-Key; Supplier Part Number 3: 296-26978-6-ND; Supplier 4: Farnell; Supplier Part Number 4: 2126004; Supplier 5: Newark; Supplier Part Number 5: 94T5094; Supplier 6: Newark; Supplier Part Number 6: 11N9832; Supplier 7: Mouser; Supplier Part Number 7: 595-TPS51200DRCR; Eco-Plan: Green (RoHS & no Sb/Br); Mounting Technology: Surface Mount; PartNumber: TPS51200DRCR; ComponentLink1Description: Manufacturer URL; ComponentLink1URL: http://www.ti.com/; ComponentLink2Description: Datasheet; ComponentLink2URL: http://www.ti.com/general/docs/lit/getliterature.tsp?genericPartNumber=TPS51200&fileType=pdf; ComponentLink3Description: Package Specification; ComponentLink3URL: http://www.ti.com/litv/pdf/mpds117k; ComponentLink4Description: URL Link1; ComponentLink4URL: Samples URL:http://www.ti.com/product/tps51200#samples
R64-R66 = YC248-JR-07-#: Набор чип резисторов; P: 0.062 Вт; Supplier 1: Digi-Key; Supplier Part Number 1: YC248-JR-0751RL
R67-R70 = CR0402-#-±5%: Чип резистор; Maximum Working Voltage: 50 В; Supplier 1: Digi-Key
  R67 R69: Supplier Part Number 1: 311-100JRTR-ND
  R68 R70: Supplier Part Number 1: 311-240JRTR-ND
R71-R76 = CR0402-#-±5%: Чип резистор; Maximum Working Voltage: 50 В; TOLERANCE: 5%; Supplier 1: Digi-Key
  R71: Supplier Part Number 1: 311-2.0KJRTR-ND
  R72: Supplier Part Number 1: 311-4.7KJRTR-ND
  R73: Supplier Part Number 1: 311-100KJRTR-ND
  R74-R76: Supplier Part Number 1: 311-10.0KJRTR-ND
U3 U4 = MT41K256M16HA-125 AIT: 4Gb DDR3-1600 SDRAM, 256Mb x 16, 1.25ns, 1.35V, -40 to 95 degC, 96-Ball FBGA, Pb-Free; Manufacturer: Micron; CL: CL = 11; Clock Rate: 800 MHz; Op. Temp.: -40C to +95C; DatasheetVersion: Rev. E; PackageVersion: Rev.E; PackageReference: MICT-HA-96; PackageDescription: 96-Ball Fine-Pitch Ball Grid Array, 14 x 9 mm, Pitch 0.8 mm; Cycle Time: 1.25ns; Data Rate: DDR3-1600; Density: 4Gb; Depth: 256Mb; Package: FBGA; Pin Count: 96-ball; RoHS: Yes; Voltage: 1.35V; Width: x16; Mounting Technology: Surface Mount; PartNumber: MT41K256M16HA-125 AIT; ComponentLink1Description: Manufacturer URL; ComponentLink1URL: http://www.micron.com/; ComponentLink2Description: Datasheet; ComponentLink2URL: http://www.micron.com/~/media/Documents/Products/Data%20Sheet/DRAM/4Gb_1_35V_DDR3L.pdf; ComponentLink3Description: Package Specification; ComponentLink3URL: http://www.micron.com/~/media/Documents/Products/Data%20Sheet/DRAM/4Gb_1_35V_DDR3L.pdf

## Sheet CLK_src&sys_logic.SchDoc
size A2
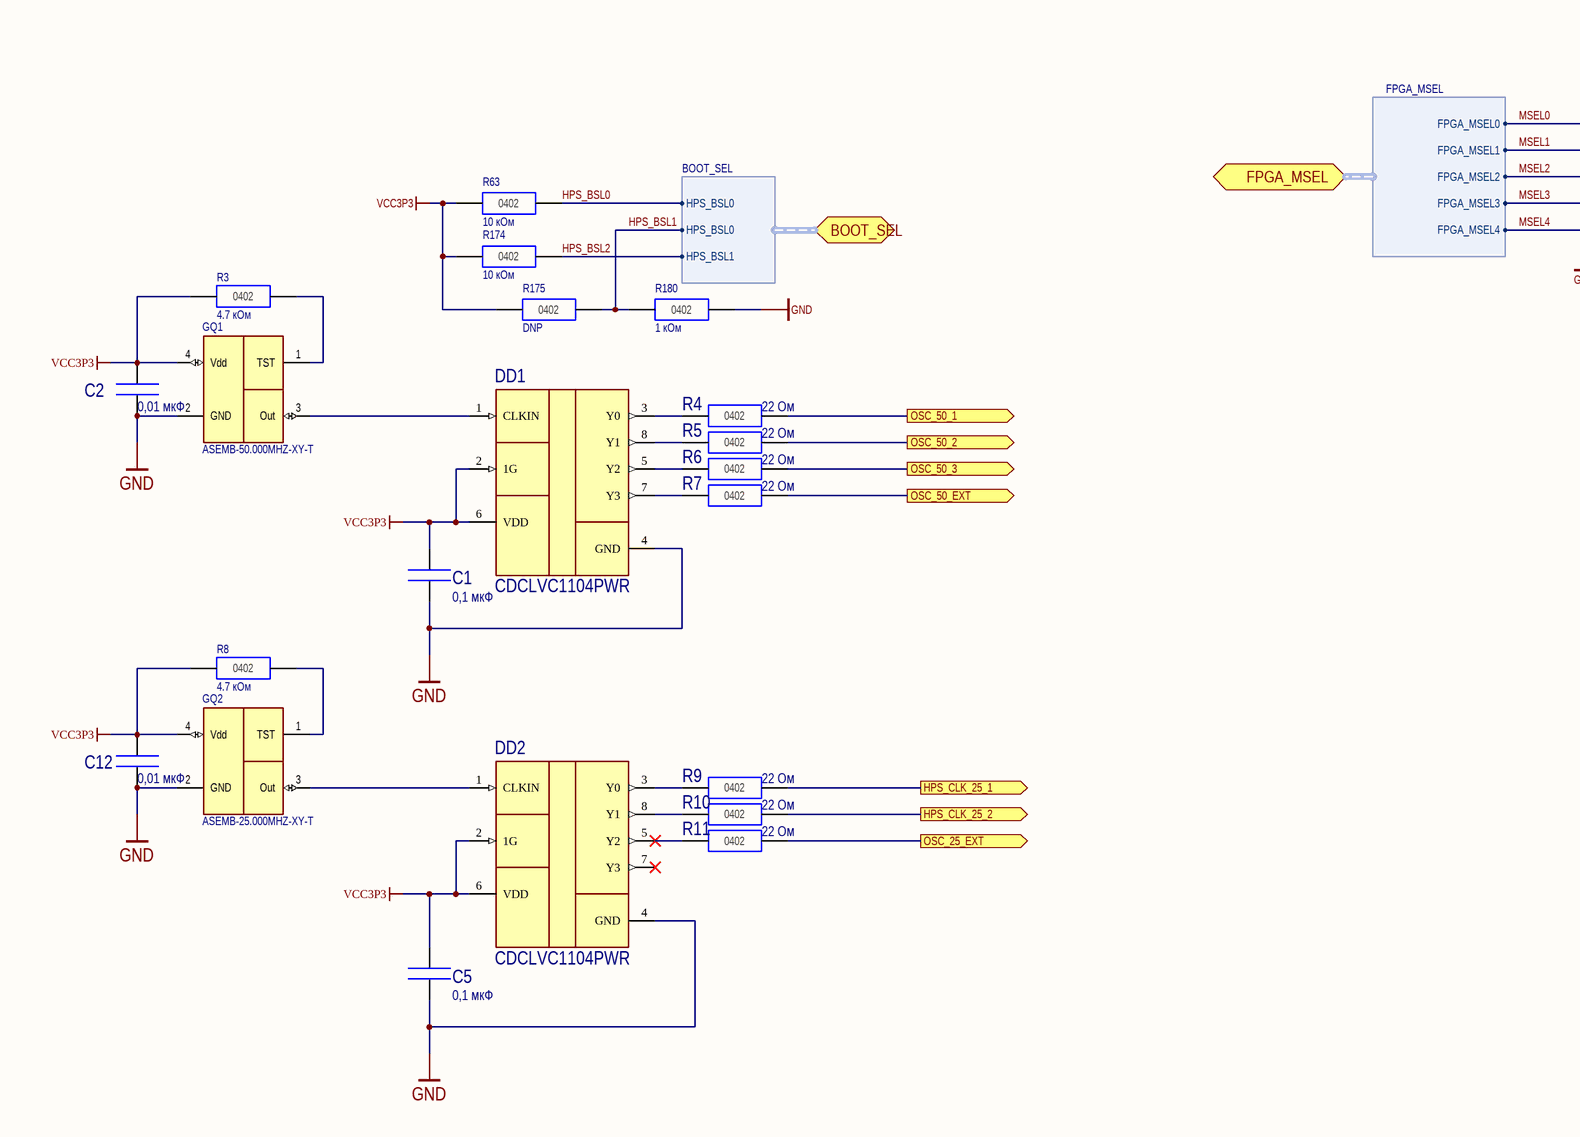
[diagram p15: CLK_src&sys_logic.SchDoc, left]
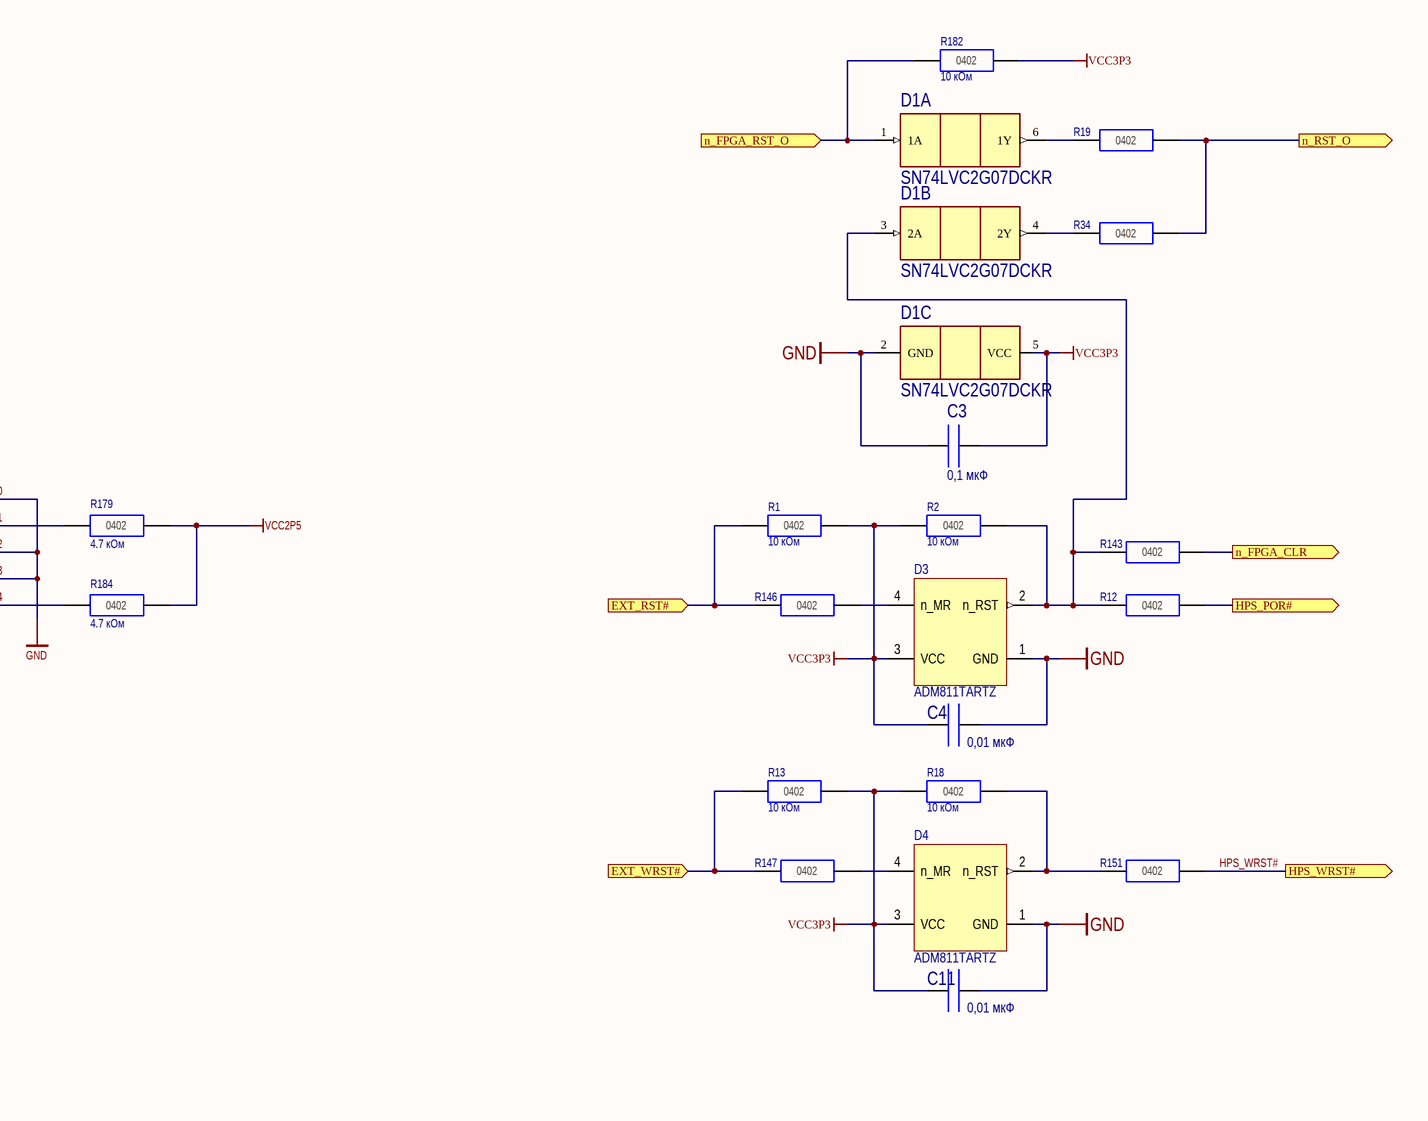
[diagram p16: CLK_src&sys_logic.SchDoc, right]

### Parts
C1  value 0,1 мкФ  [CC0402(1005)]  (hidden comment: CC0402-X7R-0,1 мкФ-20%-10В)
C2  value 0,01 мкФ  [CC0402(1005)]  (hidden comment: CC0402-X7R-0,01 мкФ-10%-50В)
C3  value 0,1 мкФ  [CC0402(1005)]  (hidden comment: CC0402-X7R-0,1 мкФ-20%-10В)
C4  value 0,01 мкФ  [CC0402(1005)]  (hidden comment: CC0402-X7R-0,01 мкФ-10%-50В)
C5  value 0,1 мкФ  [CC0402(1005)]  (hidden comment: CC0402-X7R-0,1 мкФ-20%-10В)
C11  value 0,01 мкФ  [CC0402(1005)]  (hidden comment: CC0402-X7R-0,01 мкФ-10%-50В)
C12  value 0,01 мкФ  [CC0402(1005)]  (hidden comment: CC0402-X7R-0,01 мкФ-10%-50В)
D1  SN74LVC2G07DCKR  [DCKR]  (parts A,B,C of 3)
D3  ADM811TARTZ  [SOT-143]
D4  ADM811TARTZ  [SOT-143]
DD1  CDCLVC1104PWR  [TSSOP-8]
DD2  CDCLVC1104PWR  [TSSOP-8]
GQ1  ASEMB-50.000MHZ-XY-T  [DFN210P320X100-4N]
GQ2  ASEMB-25.000MHZ-XY-T  [DFN210P320X100-4N]
R1  value 10 кОм  [CR0402(1005)]  (hidden comment: CR0402-10 кОм-±5%)
R2  value 10 кОм  [CR0402(1005)]  (hidden comment: CR0402-10 кОм-±5%)
R3  value 4.7 кОм  [CR0402(1005)]  (hidden comment: CR0402-4.7 кОм-±5%)
R4  value 22 Ом  [CR0402(1005)]  (hidden comment: CR0402-22 Ом-±5%)
R5  value 22 Ом  [CR0402(1005)]  (hidden comment: CR0402-22 Ом-±5%)
R6  value 22 Ом  [CR0402(1005)]  (hidden comment: CR0402-22 Ом-±5%)
R7  value 22 Ом  [CR0402(1005)]  (hidden comment: CR0402-22 Ом-±5%)
R8  value 4.7 кОм  [CR0402(1005)]  (hidden comment: CR0402-4.7 кОм-±5%)
R9  value 22 Ом  [CR0402(1005)]  (hidden comment: CR0402-22 Ом-±5%)
R10  value 22 Ом  [CR0402(1005)]  (hidden comment: CR0402-22 Ом-±5%)
R11  value 22 Ом  [CR0402(1005)]  (hidden comment: CR0402-22 Ом-±5%)
R12  CR0402-0 Ом-±5%  [CR0402(1005)]  (value not drawn)
R13  value 10 кОм  [CR0402(1005)]  (hidden comment: CR0402-10 кОм-±5%)
R18  value 10 кОм  [CR0402(1005)]  (hidden comment: CR0402-10 кОм-±5%)
R19  CR0402-0 Ом-±5%  [CR0402(1005)]  (value not drawn)
R34  CR0402-0 Ом-±5%  [CR0402(1005)]  (value not drawn)
R63  value 10 кОм  [CR0402(1005)]  (hidden comment: CR0402-10 кОм-±5%)
R143  CR0402-0 Ом-±5%  [CR0402(1005)]  (value not drawn)
R146  CR0402-0 Ом-±5%  [CR0402(1005)]  (value not drawn)
R147  CR0402-0 Ом-±5%  [CR0402(1005)]  (value not drawn)
R151  CR0402-0 Ом-±5%  [CR0402(1005)]  (value not drawn)
R174  value 10 кОм  [CR0402(1005)]  (hidden comment: CR0402-10 кОм-±5%)
R175  value DNP  [CR0402(1005)]  (hidden comment: CR0402-DNP-±5%)
R179  value 4.7 кОм  [CR0402(1005)]  (hidden comment: CR0402-4.7 кОм-±5%)
R180  value 1 кОм  [CR0402(1005)]  (hidden comment: CR0402-1 кОм-±5%)
R182  value 10 кОм  [CR0402(1005)]  (hidden comment: CR0402-10 кОм-±5%)
R184  value 4.7 кОм  [CR0402(1005)]  (hidden comment: CR0402-4.7 кОм-±5%)

### Ports
BOOT_SEL (harness BOOT_SEL), EXT_RST# (in), EXT_WRST# (in), FPGA_MSEL (harness FPGA_MSEL), HPS_CLK_25_1 (out), HPS_CLK_25_2 (out), HPS_POR# (out), HPS_WRST# (out), n_FPGA_CLR (out), n_FPGA_RST_O (in), n_RST_O (out), OSC_25_EXT (out), OSC_50_1 (out), OSC_50_2 (out), OSC_50_3 (out), OSC_50_EXT (out)

### Harnesses
FPGA_MSEL: FPGA_MSEL0, FPGA_MSEL1, FPGA_MSEL2, FPGA_MSEL3, FPGA_MSEL4
BOOT_SEL: HPS_BSL0, HPS_BSL0, HPS_BSL1

### Nets
GND: C1.2(-) C2.1(+) C3.1(+) C4.1(+) C5.2(-) C11.1(+) C12.1(+) D1.2(GND) D3.1(GND) D4.1(GND) DD1.4(GND) DD2.4(GND) GQ1.2(GND) GQ2.2(GND) R180.2(-) ; port FPGA_MSEL.FPGA_MSEL0, port FPGA_MSEL.FPGA_MSEL2, port FPGA_MSEL.FPGA_MSEL3  [also labelled MSEL0, MSEL2, MSEL3]  [project net MIPI_CSI_CLKA_N]
VCC2P5: R179.2(-) R184.2(-)
VCC3P3: C1.1(+) C2.2(-) C3.2(-) C4.2(-) C5.1(+) C11.2(-) C12.2(-) D1.5(VCC) D3.3(VCC) D4.3(VCC) DD1.2(1G) DD1.6(VDD) DD2.2(1G) DD2.6(VDD) GQ1.4(Vdd) GQ2.4(Vdd) R1.2(-) R2.1(+) R3.1(+) R8.1(+) R13.2(-) R18.1(+) R63.1(+) R174.1(+) R175.1(+) R182.2(-)
EXT_RST#: R1.1(+) R146.1(+) ; port EXT_RST#
HPS_BSL0: R63.2(-) R175.2(-) R180.1(+) ; port BOOT_SEL.HPS_BSL0  [also labelled HPS_BSL1]
HPS_BSL2: R174.2(-) ; port BOOT_SEL.HPS_BSL1
HPS_WRST#: R151.2(-) ; port HPS_WRST#
MSEL1: R179.1(+) ; port FPGA_MSEL.FPGA_MSEL1
MSEL4: R184.1(+) ; port FPGA_MSEL.FPGA_MSEL4
N_RST_O: R19.2(-) R34.2(-) ; port n_RST_O
NetC9_1: R4.2(-) ; port OSC_50_1
NetC10_1: R5.2(-) ; port OSC_50_2
NetD1_1: D1.1(1A) R182.1(+) ; port n_FPGA_RST_O
NetD1_3: D1.3(2A) D3.2(n_RST) R2.2(-) R12.1(+) R143.1(+)
NetD1_4: D1.4(2Y) R34.1(+)
NetD1_6: D1.6(1Y) R19.1(+)
NetD3_4: D3.4(n_MR) R146.2(-)
NetD4_2: D4.2(n_RST) R18.2(-) R151.1(+)
NetD4_4: D4.4(n_MR) R147.2(-)
NetDD1_1: DD1.1(CLKIN) GQ1.3(Out)
NetDD1_3: DD1.3(Y0) R4.1(+)
NetDD1_5: DD1.5(Y2) R6.1(+)
NetDD1_7: DD1.7(Y3) R7.1(+)
NetDD1_8: DD1.8(Y1) R5.1(+)
NetDD2_1: DD2.1(CLKIN) GQ2.3(Out)
NetDD2_3: DD2.3(Y0) R9.1(+)
NetDD2_5: DD2.5(Y2) R11.1(+)
NetDD2_8: DD2.8(Y1) R10.1(+)
NetGQ1_1: GQ1.1(TST) R3.2(-)
NetGQ2_1: GQ2.1(TST) R8.2(-)
NetR6_2: R6.2(-) ; port OSC_50_3
NetR7_2: R7.2(-) ; port OSC_50_EXT
NetR9_2: R9.2(-) ; port HPS_CLK_25_1
NetR10_2: R10.2(-) ; port HPS_CLK_25_2
NetR11_2: R11.2(-) ; port OSC_25_EXT
NetR12_2: R12.2(-) ; port HPS_POR#
NetR13_1: R13.1(+) R147.1(+) ; port EXT_WRST#
NetR143_2: R143.2(-) ; port n_FPGA_CLR

Not connected (* = marked no-connect by the designer): DD2 7(Y3)*

### Notes on the sheet
- (in symbol CR0402-#-±5%) 0402

### Library data of the parts
C1-C5 C11 C12 = CC0402-X7R-#-20%-10В: Чип конденсатор керамический; Supplier 1: Digi-Key
  C1 C3 C5: Supplier Part Number 1: 399-3520-1-ND
  C2 C4 C11 C12: Supplier Part Number 1: 490-4516-2-ND
D1 = IC_TI_SN74LVC2G07: Dual Buffer and Driver With Open-Drain Outputs; Supplier 1: Digi-Key; Supplier Part Number 1: 296-13495-2-ND
D3 D4 = IC_AD_ADM811TARTZ: Microprocessor Supervisory Circuit in 3-Pin SOT-23; LatestRevisionNote: Re-released for DXP Platform.; DatasheetVersion: REV.H 2016; Publisher: Altium Limited; PackageDescription: SOT-143; 4 Leads; Body 3.0 x 2.6 mm, inc. leads (LxW max); ComponentLink1Description: Manufacturer Link; ComponentLink1URL: http://www.analog.com/en/products/power-management/supervisory/simple-reset-supervisory-ic/adm811.html?doc=adm811_812.pdf; ComponentLink2Description: Datasheet; ComponentLink2URL: http://www.analog.com/en/products/power-management/supervisory/simple-reset-supervisory-ic/adm811.html?doc=adm811_812.pdf#product-overview
DD1 DD2 = CDCLVC1104PWR: High-Performance  Clock Buffer 1:4; Supplier 1: Digi-Key; Supplier Part Number 1: 296-27549-1-ND
GQ1 GQ2 = OSC-ABRCN-ASE3: Dual High Side Switch With OC_DET 500mA/CH; Manufacturer Name: Abracon LLC
  GQ1: Manufacturer Part No.: ASEMB-50.000MHZ-XY-T
  GQ2: Manufacturer Part No.: ASEMB-25.000MHZ-XY-T
R1-R11 R13 R18 R63 R174 R175 R179 R180 R182 R184 = CR0402-#-±5%: as R71-R76 on sheet HPS_DDR3; Supplier 1: Digi-Key
  R1 R2 R13 R18 R63 R174 R175 R182: Supplier Part Number 1: 311-10.0KJRTR-ND
  R3 R8 R179 R184: Supplier Part Number 1: 311-4.7KJRTR-ND
  R4-R7 R9-R11: Supplier Part Number 1: 311-10.0KLRDKR-ND
  R180: Supplier Part Number 1: 311-1.0KJRTR-ND
R12 R19 R34 R143 R146 R147 R151 = CR0402-#-±5%: Чип резистор; Maximum Working Voltage: 50 В; TOLERANCE: 5%; VALUE: 0 Ом; Supplier 1: Digi-Key; Supplier Part Number 1: 311-10.0KLRDKR-ND

## Sheet SoC_pwr_2.SchDoc
size A1
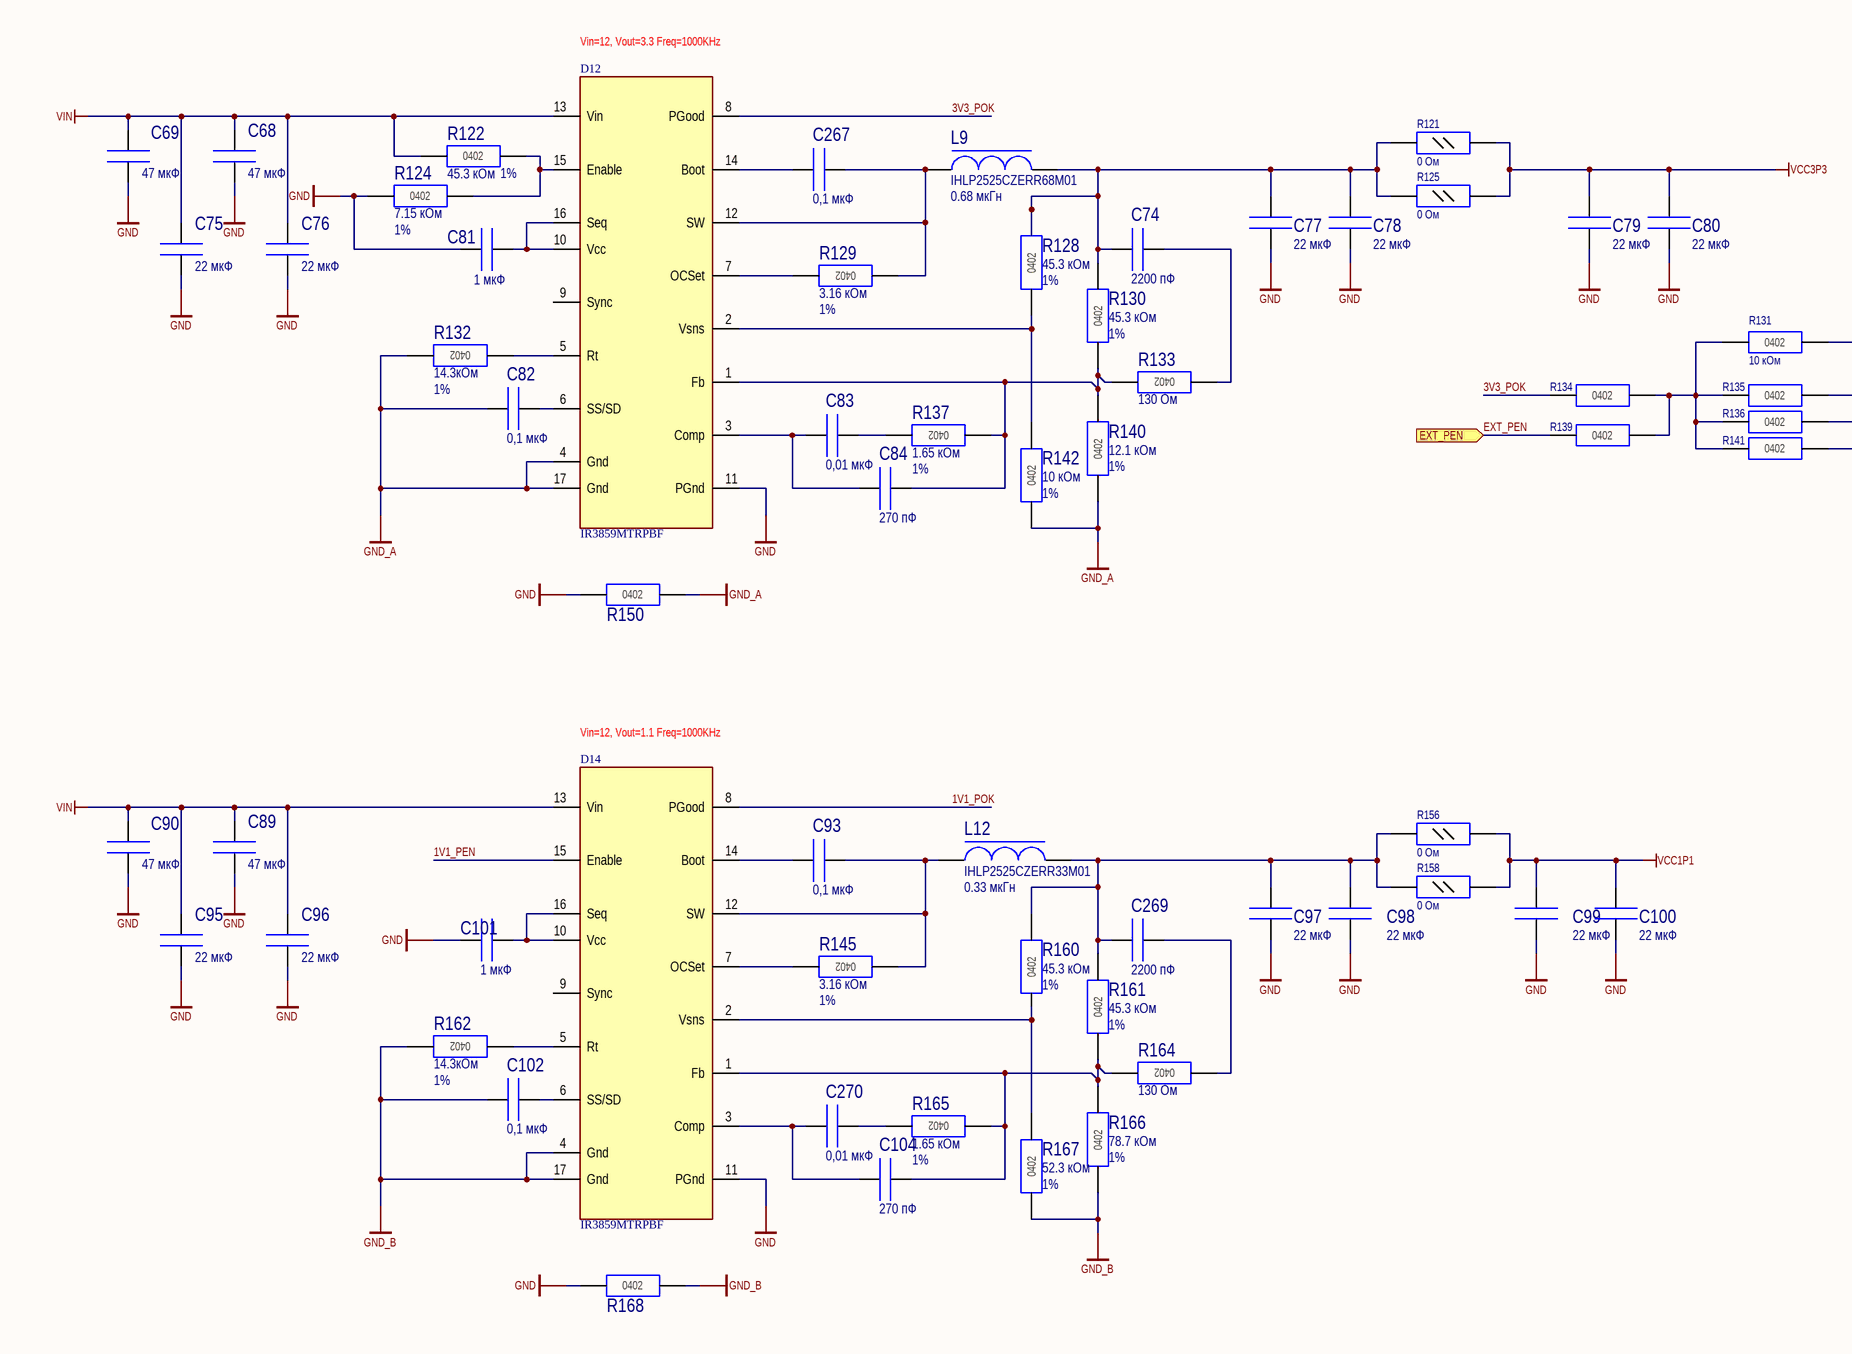
[diagram p17: SoC_pwr_2.SchDoc, left]
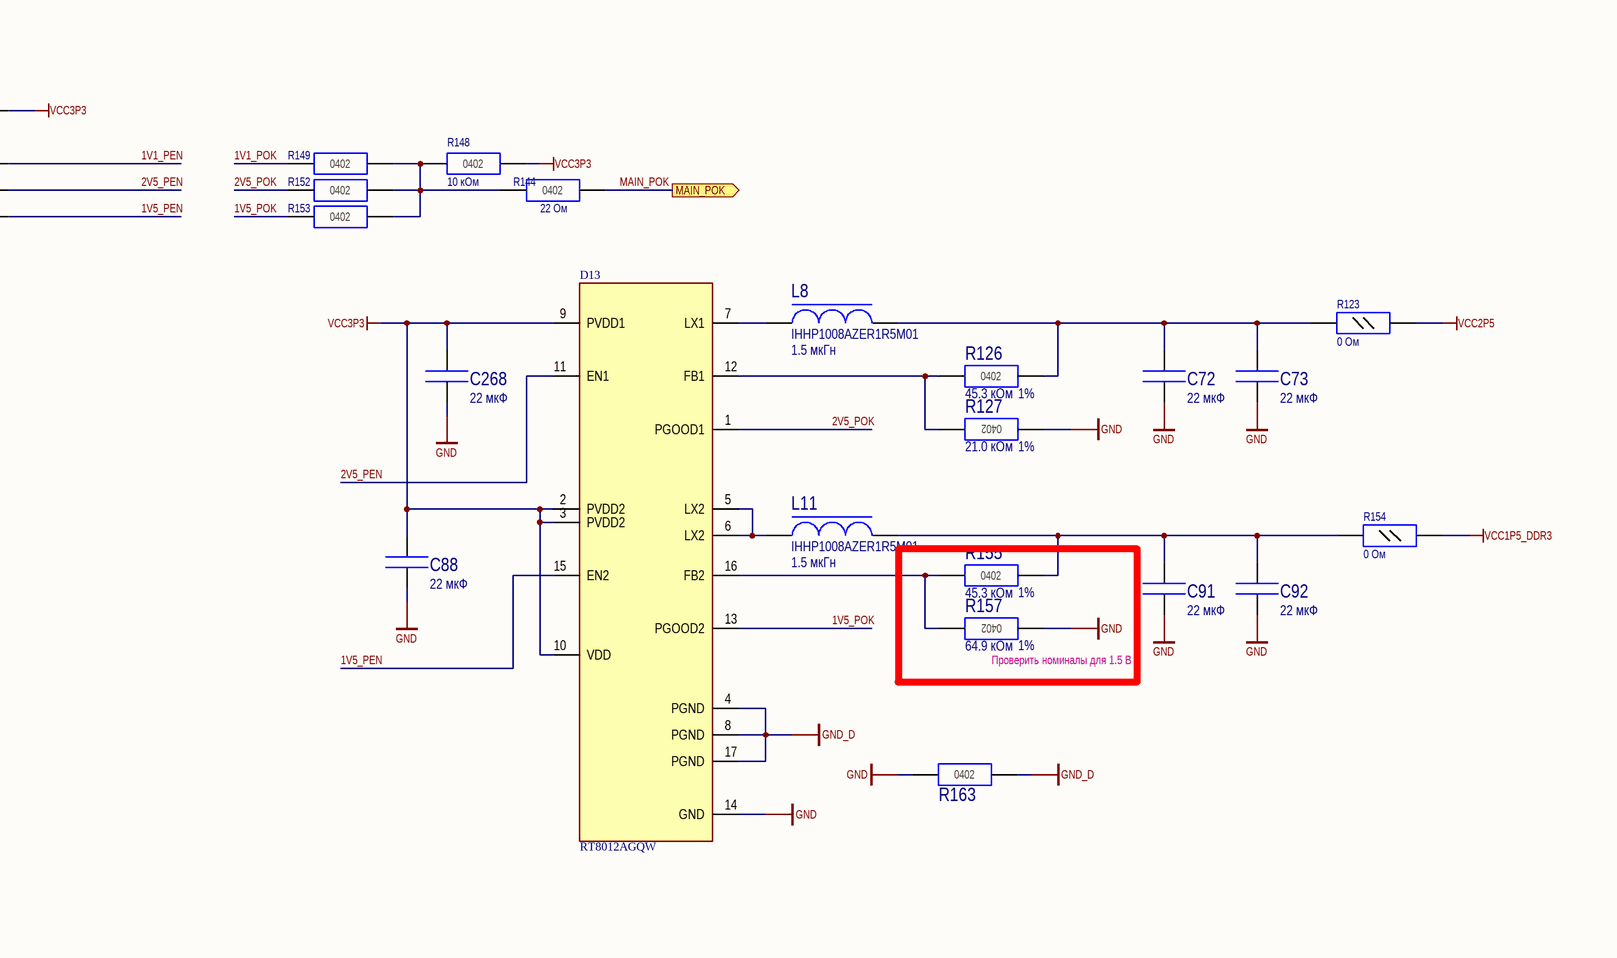
[diagram p18: SoC_pwr_2.SchDoc, right]

### Parts
C68  value 47 мкФ  [CC0603]  (hidden comment: CC0603-X5R-47 мкФ-20%-6,3В)
C69  value 47 мкФ  [CC0603]  (hidden comment: CC0603-X5R-47 мкФ-20%-6,3В)
C72  value 22 мкФ  [CC0603]  (hidden comment: CC0603-X5R-22 мкФ-20%-6,3В)
C73  value 22 мкФ  [CC0603]  (hidden comment: CC0603-X5R-22 мкФ-20%-6,3В)
C74  value 2200 пФ  [CC0402(1005)]  (hidden comment: CC0402-X7R-2200 пФ-10%-16В)
C75  value 22 мкФ  [CC0603]  (hidden comment: CC0603-X5R-22 мкФ-20%-6,3В)
C76  value 22 мкФ  [CC0603]  (hidden comment: CC0603-X5R-22 мкФ-20%-6,3В)
C77  value 22 мкФ  [CC0603]  (hidden comment: CC0603-X5R-22 мкФ-20%-6,3В)
C78  value 22 мкФ  [CC0603]  (hidden comment: CC0603-X5R-22 мкФ-20%-6,3В)
C79  value 22 мкФ  [CC0603]  (hidden comment: CC0603-X5R-22 мкФ-20%-6,3В)
C80  value 22 мкФ  [CC0603]  (hidden comment: CC0603-X5R-22 мкФ-20%-6,3В)
C81  value 1 мкФ  [CC0603]  (hidden comment: CC0603-X5R-1 мкФ-10%-25В)
C82  value 0,1 мкФ  [CC0402(1005)]  (hidden comment: CC0402-X7R-0,1 мкФ-20%-10В)
C83  value 0,01 мкФ  [CC0402(1005)]  (hidden comment: CC0402-X7R-0,01 мкФ-10%-50В)
C84  value 270 пФ  [CC0402(1005)]  (hidden comment: CC0402-NP0-270 пФ-1%-50В)
C88  value 22 мкФ  [CC0603]  (hidden comment: CC0603-X5R-22 мкФ-20%-6,3В)
C89  value 47 мкФ  [CC0603]  (hidden comment: CC0603-X5R-47 мкФ-20%-6,3В)
C90  value 47 мкФ  [CC0603]  (hidden comment: CC0603-X5R-47 мкФ-20%-6,3В)
C91  value 22 мкФ  [CC0603]  (hidden comment: CC0603-X5R-22 мкФ-20%-6,3В)
C92  value 22 мкФ  [CC0603]  (hidden comment: CC0603-X5R-22 мкФ-20%-6,3В)
C93  value 0,1 мкФ  [CC0402(1005)]  (hidden comment: CC0402-X7R-0,1 мкФ-20%-10В)
C95  value 22 мкФ  [CC0603]  (hidden comment: CC0603-X5R-22 мкФ-20%-6,3В)
C96  value 22 мкФ  [CC0603]  (hidden comment: CC0603-X5R-22 мкФ-20%-6,3В)
C97  value 22 мкФ  [CC0603]  (hidden comment: CC0603-X5R-22 мкФ-20%-6,3В)
C98  value 22 мкФ  [CC0603]  (hidden comment: CC0603-X5R-22 мкФ-20%-6,3В)
C99  value 22 мкФ  [CC0603]  (hidden comment: CC0603-X5R-22 мкФ-20%-6,3В)
C100  value 22 мкФ  [CC0603]  (hidden comment: CC0603-X5R-22 мкФ-20%-6,3В)
C101  value 1 мкФ  [CC0603]  (hidden comment: CC0603-X5R-1 мкФ-10%-25В)
C102  value 0,1 мкФ  [CC0402(1005)]  (hidden comment: CC0402-X7R-0,1 мкФ-20%-10В)
C104  value 270 пФ  [CC0402(1005)]  (hidden comment: CC0402-NP0-270 пФ-1%-50В)
C267  value 0,1 мкФ  [CC0402(1005)]  (hidden comment: CC0402-X7R-0,1 мкФ-20%-10В)
C268  value 22 мкФ  [CC0603]  (hidden comment: CC0603-X5R-22 мкФ-20%-6,3В)
C269  value 2200 пФ  [CC0402(1005)]  (hidden comment: CC0402-X7R-2200 пФ-10%-16В)
C270  value 0,01 мкФ  [CC0402(1005)]  (hidden comment: CC0402-X7R-0,01 мкФ-10%-50В)
D12  IR3859MTRPBF  [IR3859]
D13  RT8012AGQW  [RT8012AGQW]
D14  IR3859MTRPBF  [IR3859]
L8  IHHP1008AZER1R5M01  value 1.5 мкГн  [INDC2720X12L]
L9  IHLP2525CZERR68M01  value 0.68 мкГн  [INDP6965X30L]
L11  IHHP1008AZER1R5M01  value 1.5 мкГн  [INDC2720X12L]
L12  IHLP2525CZERR33M01  value 0.33 мкГн  [INDP6965X30L]
R121  value 0 Ом  [CR0805]  (hidden comment: CR0805-0 Ом-±5%)
R122  value 45.3 кОм  TOLERANCE: 1%  [CR0402(1005)]  (hidden comment: CR0402-45.3 кОм-±1%)
R123  value 0 Ом  [CR0805]  (hidden comment: CR0805-0 Ом-±5%)
R124  value 7.15 кОм  TOLERANCE: 1%  [CR0402(1005)]  (hidden comment: CR0402-7.15 кОм-±1%)
R125  value 0 Ом  [CR0805]  (hidden comment: CR0805-0 Ом-±5%)
R126  value 45.3 кОм  TOLERANCE: 1%  [CR0402(1005)]  (hidden comment: CR0402-45.3 кОм-±1%)
R127  value 21.0 кОм  TOLERANCE: 1%  [CR0402(1005)]  (hidden comment: CR0402-21.0 кОм-±1%)
R128  value 45.3 кОм  TOLERANCE: 1%  [CR0402(1005)]  (hidden comment: CR0402-45.3 кОм-±1%)
R129  value 3.16 кОм  TOLERANCE: 1%  [CR0402(1005)]  (hidden comment: CR0402-3.16 кОм-±1%)
R130  value 45.3 кОм  TOLERANCE: 1%  [CR0402(1005)]  (hidden comment: CR0402-45.3 кОм-±1%)
R131  value 10 кОм  [CR0402(1005)]  (hidden comment: CR0402-10 кОм-±5%)
R132  value 14.3кОм  TOLERANCE: 1%  [CR0402(1005)]  (hidden comment: CR0402-14.3кОм-±1%)
R133  value 130 Ом  [CR0402(1005)]  (hidden comment: CR0402-130 Ом-±1%)
R134  CR0402-0 Ом-±5%  [CR0402(1005)]  (value not drawn)
R135  CR0402-0 Ом-±5%  [CR0402(1005)]  (value not drawn)
R136  CR0402-0 Ом-±5%  [CR0402(1005)]  (value not drawn)
R137  value 1.65 кОм  TOLERANCE: 1%  [CR0402(1005)]  (hidden comment: CR0402-1.65 кОм-±1%)
R139  CR0402-0 Ом-±5%  [CR0402(1005)]  (value not drawn)
R140  value 12.1 кОм  TOLERANCE: 1%  [CR0402(1005)]  (hidden comment: CR0402-12.1 кОм-±1%)
R141  CR0402-0 Ом-±5%  [CR0402(1005)]  (value not drawn)
R142  value 10 кОм  TOLERANCE: 1%  [CR0402(1005)]  (hidden comment: CR0402-10 кОм-±1%)
R144  value 22 Ом  [CR0402(1005)]  (hidden comment: CR0402-22 Ом-±5%)
R145  value 3.16 кОм  TOLERANCE: 1%  [CR0402(1005)]  (hidden comment: CR0402-3.16 кОм-±1%)
R148  value 10 кОм  [CR0402(1005)]  (hidden comment: CR0402-10 кОм-±5%)
R149  CR0402-0 Ом-±5%  [CR0402(1005)]  (value not drawn)
R150  CR0402-0 Ом-±5%  [CR0402(1005)]  (value not drawn)
R152  CR0402-0 Ом-±5%  [CR0402(1005)]  (value not drawn)
R153  CR0402-0 Ом-±5%  [CR0402(1005)]  (value not drawn)
R154  value 0 Ом  [CR0805]  (hidden comment: CR0805-0 Ом-±5%)
R155  value 45.3 кОм  TOLERANCE: 1%  [CR0402(1005)]  (hidden comment: CR0402-45.3 кОм-±1%)
R156  value 0 Ом  [CR0805]  (hidden comment: CR0805-0 Ом-±5%)
R157  value 64.9 кОм  TOLERANCE: 1%  [CR0402(1005)]  (hidden comment: CR0402-64.9 кОм-±1%)
R158  value 0 Ом  [CR0805]  (hidden comment: CR0805-0 Ом-±5%)
R160  value 45.3 кОм  TOLERANCE: 1%  [CR0402(1005)]  (hidden comment: CR0402-45.3 кОм-±1%)
R161  value 45.3 кОм  TOLERANCE: 1%  [CR0402(1005)]  (hidden comment: CR0402-45.3 кОм-±1%)
R162  value 14.3кОм  TOLERANCE: 1%  [CR0402(1005)]  (hidden comment: CR0402-14.3кОм-±1%)
R163  CR0402-0 Ом-±5%  [CR0402(1005)]  (value not drawn)
R164  value 130 Ом  [CR0402(1005)]  (hidden comment: CR0402-130 Ом-±1%)
R165  value 1.65 кОм  TOLERANCE: 1%  [CR0402(1005)]  (hidden comment: CR0402-1.65 кОм-±1%)
R166  value 78.7 кОм  TOLERANCE: 1%  [CR0402(1005)]  (hidden comment: CR0402-78.7 кОм-±1%)
R167  value 52.3 кОм  TOLERANCE: 1%  [CR0402(1005)]  (hidden comment: CR0402-52.3 кОм-±1%)
R168  CR0402-0 Ом-±5%  [CR0402(1005)]  (value not drawn)

### Blocks framed on the sheet
Проверить номиналы для 1.5 В: R155 R157

### Ports
EXT_PEN (in), MAIN_POK (out)

### Nets
GND: C68.2(-) C69.2(-) C72.2(-) C73.2(-) C75.2(-) C76.2(-) C77.2(-) C78.2(-) C79.2(-) C80.2(-) C81.1(+) C88.2(-) C89.2(-) C90.2(-) C91.2(-) C92.2(-) C95.2(-) C96.2(-) C97.2(-) C98.2(-) C99.2(-) C100.2(-) C101.1(+) C268.2(-) D12.11(PGnd) D13.14(GND) D14.11(PGnd) R124.1(+) R127.1(+) R150.1(+) R157.1(+) R163.1(+) R168.1(+)  [project net MIPI_CSI_CLKA_N]
GND_A: C82.1(+) D12.4(Gnd) D12.17(Gnd) R132.2(-) R140.1(+) R142.1(+) R150.2(-)
GND_B: C102.1(+) D14.4(Gnd) D14.17(Gnd) R162.2(-) R166.1(+) R167.1(+) R168.2(-)
GND_D: D13.4(PGND) D13.8(PGND) D13.17(PGND) R163.2(-)
VCC1P1: C99.1(+) C100.1(+) R156.2(-) R158.2(-)
VCC1P5_DDR3: R154.2(-)
VCC2P5: R123.2(-)
VCC3P3: C79.1(+) C80.1(+) C88.1(+) C268.1(+) D13.2(PVDD2) D13.3(PVDD2) D13.9(PVDD1) D13.10(VDD) R121.2(-) R125.2(-) R131.2(-) R148.2(-)
VIN: C68.1(+) C69.1(+) C75.1(+) C76.1(+) C89.1(+) C90.1(+) C95.1(+) C96.1(+) D12.13(Vin) D14.13(Vin) R122.1(+)
1V1_PEN: D14.15(Enable) R135.2(-)
1V1_POK: D14.8(PGood) R149.1(+)
1V5_PEN: D13.15(EN2) R141.2(-)
1V5_POK: D13.13(PGOOD2) R153.1(+)
2V5_PEN: D13.11(EN1) R136.2(-)
2V5_POK: D13.1(PGOOD1) R152.1(+)
3V3_POK: D12.8(PGood) R134.1(+)
EXT_PEN: R139.1(+) ; port EXT_PEN
MAIN_POK: R144.2(-) ; port MAIN_POK
NetC72_1: C72.1(+) C73.1(+) L8.2 R123.1(+) R126.2(-)
NetC74_1: C74.1(+) R133.1(+)
NetC74_2: C74.2(-) C77.1(+) C78.1(+) L9.2 R121.1(+) R125.1(+) R128.2(-) R130.2(-)
NetC81_2: C81.2(-) D12.10(Vcc) D12.16(Seq)
NetC82_2: C82.2(-) D12.6(SS/SD)
NetC83_1: C83.1(+) C84.2(-) D12.3(Comp)
NetC83_2: C83.2(-) R137.2(-)
NetC84_1: C84.1(+) D12.1(Fb) R130.1(+) R133.2(-) R137.1(+) R140.2(-)
NetC91_1: C91.1(+) C92.1(+) L11.2 R154.1(+) R155.2(-)
NetC93_1: C93.1(+) D14.14(Boot)
NetC93_2: C93.2(-) D14.12(SW) L12.1 R145.1(+)
NetC97_1: C97.1(+) C98.1(+) C269.2(-) L12.2 R156.1(+) R158.1(+) R160.2(-) R161.2(-)
NetC101_2: C101.2(-) D14.10(Vcc) D14.16(Seq)
NetC102_2: C102.2(-) D14.6(SS/SD)
NetC104_1: C104.1(+) D14.1(Fb) R161.1(+) R164.2(-) R165.1(+) R166.2(-)
NetC104_2: C104.2(-) C270.1(+) D14.3(Comp)
NetC267_1: C267.1(+) D12.14(Boot)
NetC267_2: C267.2(-) D12.12(SW) L9.1 R129.1(+)
NetC269_1: C269.1(+) R164.1(+)
NetC270_2: C270.2(-) R165.2(-)
NetD12_2: D12.2(Vsns) R128.1(+) R142.2(-)
NetD12_5: D12.5(Rt) R132.1(+)
NetD12_7: D12.7(OCSet) R129.2(-)
NetD12_15: D12.15(Enable) R122.2(-) R124.2(-)
NetD13_5: D13.5(LX2) D13.6(LX2) L11.1
NetD13_7: D13.7(LX1) L8.1
NetD13_12: D13.12(FB1) R126.1(+) R127.2(-)
NetD13_16: D13.16(FB2) R155.1(+) R157.2(-)
NetD14_2: D14.2(Vsns) R160.1(+) R167.2(-)
NetD14_5: D14.5(Rt) R162.1(+)
NetD14_7: D14.7(OCSet) R145.2(-)
NetR131_1: R131.1(+) R134.2(-) R135.1(+) R136.1(+) R139.2(-) R141.1(+)
NetR144_1: R144.1(+) R148.1(+) R149.2(-) R152.2(-) R153.2(-)

Not connected (* = marked no-connect by the designer): D12 9(Sync); D14 9(Sync)

### Notes on the sheet
- Vin=12, Vout=3.3 Freq=1000KHz
- Vin=12, Vout=1.1 Freq=1000KHz
- (in symbol CR0402-#-±1%) 0402
- (in symbol CR0402-#-±5%) 0402

### Library data of the parts
C68 C69 C89 C90 = CC0603-X5R-#-20%-6,3В: Чип конденсатор керамический; Vendor: Yageo; Vendor P/N: CC0603MKX5R4BB476; Supplier 1: Digi-key; Supplier Part Number 1: 311-3491-2-ND
C72 C73 C75-C80 C88 C91 C92 C95-C100 C268 = CC0603-X5R-#-20%-6,3В: Чип конденсатор керамический; Vendor: TDK; Vendor P/N: C1608X5R0J226M080AC; Supplier 1: Digi-key; Supplier Part Number 1: 445-8028-2-ND
C74 C82-C84 C93 C102 C104 C267 C269 C270 = CC0402-X7R-#-20%-10В: Чип конденсатор керамический; Supplier 1: Digi-Key
  C74 C269: Supplier Part Number 1: 490-3190-2-ND
  C82 C93 C102 C267: Supplier Part Number 1: 399-3520-1-ND
  C83 C270: Supplier Part Number 1: 490-4516-2-ND
  C84 C104: Supplier Part Number 1: 490-10686-2-ND
C81 C101 = CC0603-X5R-#-20%-6,3В: Чип конденсатор керамический; Компэл: CC0603KRX5R8BB105 (YAG); Supplier 1: Digi-Key; Supplier Part Number 1: 311-1445-2-ND
D12 D14 = IR3859MPbF: IC REG BUCK ADJ 9A SYNC 17PQFN; Supplier: Digi-key: IR3859MTRPBFCT-ND
L8 L11 = L_VISH_IIHHP1008ABE_1: FIXED IND 1.5UH 2.4A 96 MOHM SMD; Supplier 1: Digi-Key; Supplier Part Number 1: 541-2676-6-ND
L9 L12 = L_VISH_IHLP2525CZERR68M01: FIXED IND 680NH 15.5A 5.5 MOHM; Supplier 1: Digi-Key
  L9: Supplier Part Number 1: 541-1004-1-ND
  L12: Supplier Part Number 1: 541-1002-2-ND
R121 R123 R125 R154 R156 R158 = CR0805-#-±5%: Чип резистор; Supplier 1: Digi-Key; Supplier Part Number 1: 311-0.0JRDKR-ND
R122 R124 R126-R130 R132 R133 R137 R140 R142 R145 R155 R157 R160-R162 R164-R167 = CR0402-#-±1%: Чип резистор; Maximum Working Voltage: 50 В; Supplier 1: Digi-Key
  R122 R126 R128 R130 R155 R160 R161: Supplier Part Number 1: 311-45.3KLRTR-ND
  R124: Supplier Part Number 1: YAG3235TR-ND
  R127: Supplier Part Number 1: 311-21.0KLRTR-ND
  R129 R145: Supplier Part Number 1: RC0402FR-073K16L
  R132 R162: Supplier Part Number 1: 311-14.3KLRCT-ND
  R133 R164: Supplier Part Number 1: RC0402FR-07130RL
  R137 R165: Supplier Part Number 1: RC0402FR-071K65L
  R140: Supplier Part Number 1: 311-12.1KLRTR-ND
  R142: Supplier Part Number 1: RC0402FR-0710KL
  R157: Supplier Part Number 1: 311-649KLRTR-ND
  R166: Supplier Part Number 1: 311-78.7KLRTR-ND
  R167: Supplier Part Number 1: RC0402FR-0752K3L
R131 R144 R148 = CR0402-#-±5%: as R71-R76 on sheet HPS_DDR3; Supplier 1: Digi-Key
  R131 R148: Supplier Part Number 1: 311-10.0KJRTR-ND
  R144: Supplier Part Number 1: 311-10.0KLRDKR-ND
R134-R136 R139 R141 R149 R150 R152 R153 R163 R168 = CR0402-#-±5%: as R12 on sheet CLK_src&sys_logic; Supplier 1: Digi-Key; Supplier Part Number 1: 311-10.0KLRDKR-ND

## Nets that join several sheets
MIPI_CSI_CLKA_N: FPGA_DDR3&IO (74 pins), Conn_A (34 pins), Conn_B (66 pins), Conn_C (68 pins), HPS_DDR3 (68 pins), CLK_src&sys_logic (15 pins), SoC_pwr_2 (33 pins)
VCC1P5_DDR3: FPGA_DDR3&IO (40 pins), HPS_DDR3 (40 pins), SoC_pwr_2 (R154.2)
VCC2P5: FPGA_DDR3&IO (R43.2 R45.2), Conn_A (8 pins), Conn_B (9 pins), Conn_C (X3.91 X3.92 X3.93), CLK_src&sys_logic (R179.2 R184.2), SoC_pwr_2 (R123.2)
VCC3P3: FPGA_DDR3&IO (C16.1 D5.10 R55.1 R56.1), Conn_A (12 pins), Conn_B (13 pins), Conn_C (X3.2 X3.168), HPS_DDR3 (C47.1 D8.10 R73.1 R74.1), CLK_src&sys_logic (26 pins), SoC_pwr_2 (12 pins)
VIN: Conn_A (15 pins), SoC_pwr_2 (11 pins)
EXT_PEN: Conn_A (X1.117), SoC_pwr_2 (R139.1)
EXT_RST#: Conn_A (X1.115), CLK_src&sys_logic (R1.1 R146.1)
LVDS0_CKI_N: FPGA_DDR3&IO (D2.Y16), Conn_C (X3.79)
LVDS0_CKI_P: FPGA_DDR3&IO (D2.W15), Conn_C (X3.75)
LVDS0_RX0_N: FPGA_DDR3&IO (D2.AG11), Conn_C (X3.47)
LVDS0_RX0_P: FPGA_DDR3&IO (D2.AF11), Conn_C (X3.43)
LVDS0_RX1_N: FPGA_DDR3&IO (D2.AB13), Conn_C (X3.55)
LVDS0_RX1_P: FPGA_DDR3&IO (D2.AA13), Conn_C (X3.51)
LVDS0_RX2_N: FPGA_DDR3&IO (D2.AF13), Conn_C (X3.63)
LVDS0_RX2_P: FPGA_DDR3&IO (D2.AE13), Conn_C (X3.59)
LVDS0_RX3_N: FPGA_DDR3&IO (D2.AE14), Conn_C (X3.71)
LVDS0_RX3_P: FPGA_DDR3&IO (D2.AD14), Conn_C (X3.67)
MAIN_POK: Conn_A (X1.118), SoC_pwr_2 (R144.2)
N_RST_O: Conn_A (X1.116), CLK_src&sys_logic (R19.2 R34.2)
NetC9_1: FPGA_DDR3&IO (C9.1), CLK_src&sys_logic (R4.2)
NetC10_1: FPGA_DDR3&IO (C10.1), CLK_src&sys_logic (R5.2)
NetR7_2: Conn_A (X1.103), CLK_src&sys_logic (R7.2)
NetR11_2: Conn_A (X1.99), CLK_src&sys_logic (R11.2)
NetR13_1: Conn_A (X1.119), CLK_src&sys_logic (R13.1 R147.1)

## Assembly variants
NO MEMORY NO SDRAM NO BLUETOOTH DIMS_DSP_V4.1.1: not fitted DA1 DD4 MP1 XP2 XS1
FULL COMPLECT DIMS_DSP_V4.1.1: not fitted XP2 XS1